# Altium project BEE-1012 PAY-IF V110.PrjPcb (part 7 of 8)

## Sheet TEMP.SchDoc
size 420 x 297 mm; SheetNumber: 18; SheetTotal: 32
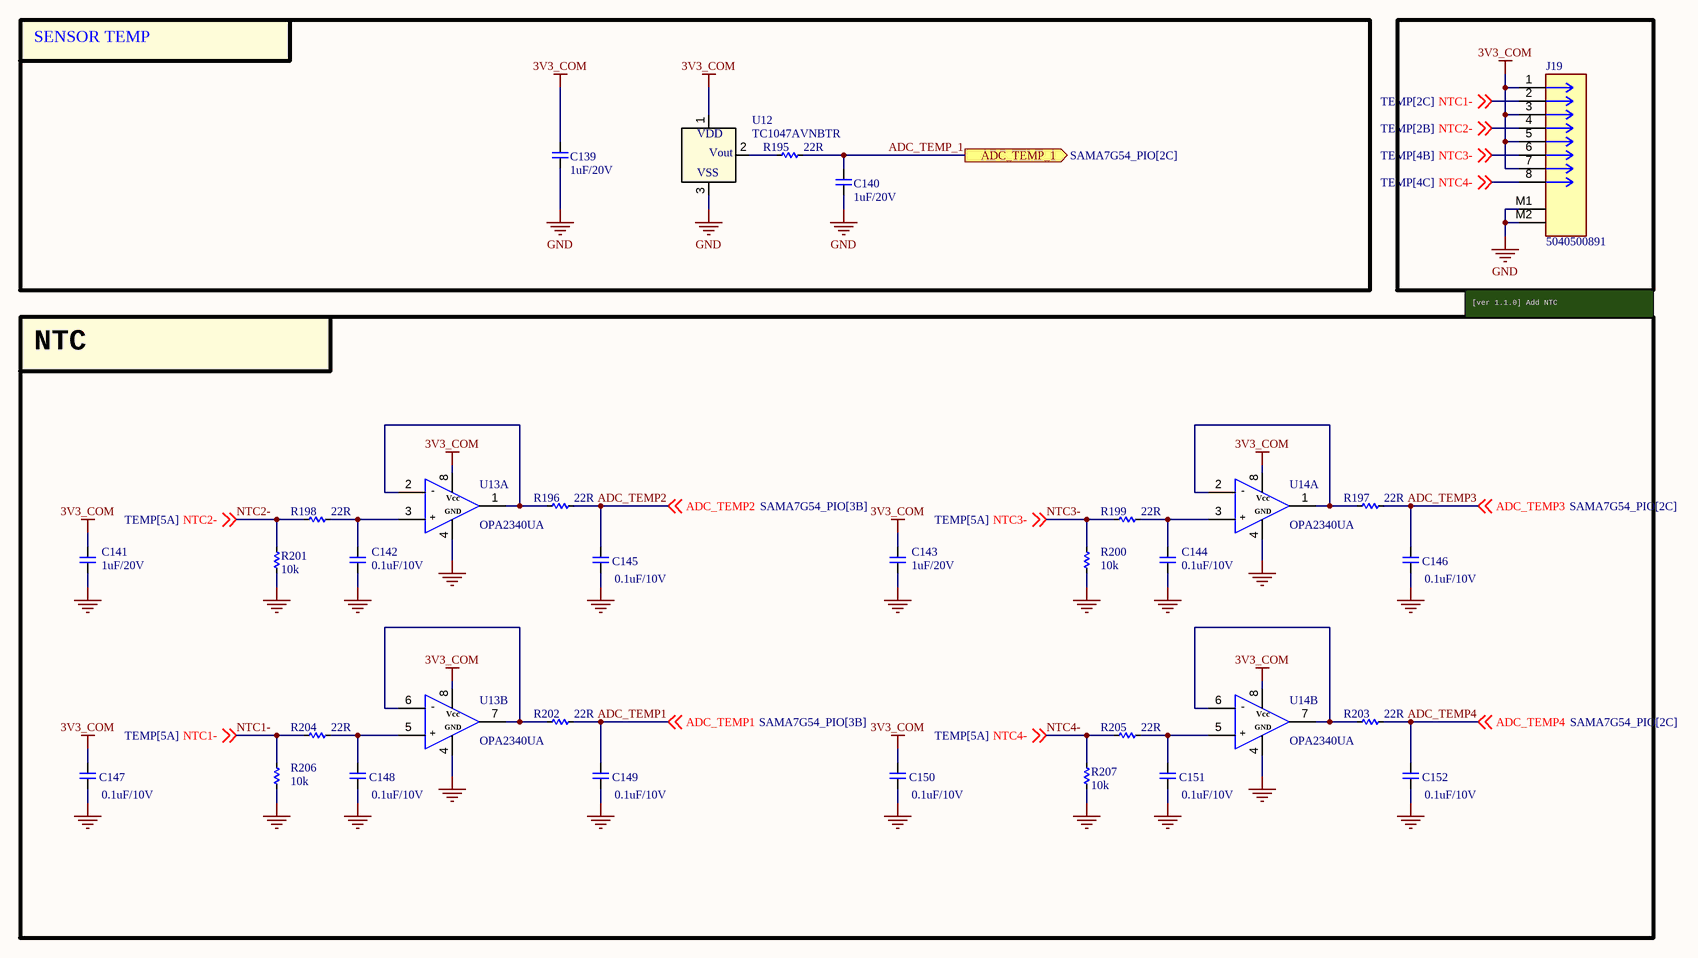
[diagram p19: TEMP.SchDoc]

### Parts
(Parts that share a designator on the sheet are numbered #1, #2 ... from top to bottom, then left to right.)
C139  1uF/20V  [CAP_C_1005X50_L]
C140  1uF/20V  [CAP_C_1005X50_L]
C141  1uF/20V  [CAP_C_1005X50_L]
C142  0.1uF/10V  [CAP_C_1005X50_L]
C143  1uF/20V  [CAP_C_1005X50_L]
C144  0.1uF/10V  [CAP_C_1005X50_L]
C145  0.1uF/10V  [CAP_C_1005X50_L]
C146  0.1uF/10V  [CAP_C_1005X50_L]
C147  0.1uF/10V  [CAP_C_1005X50_L]
C148  0.1uF/10V  [CAP_C_1005X50_L]
C149  0.1uF/10V  [CAP_C_1005X50_L]
C150#2  0.1uF/10V  [CAP_C_1005X50_L]
C151  0.1uF/10V  [CAP_C_1005X50_L]
C152  0.1uF/10V  [CAP_C_1005X50_L]
J19  5040500891  [MOLEX_5040500891]
R195  22R  [RES_C_1005x30_L]
R196  22R  [RES_C_1005x30_L]
R197  22R  [RES_C_1005x30_L]
R198  22R  [RES_C_1005x30_L]
R199  22R  [RES_C_1005x30_L]
R200  10k  [RES_C_1005x30_L]
R201  10k  [RES_C_1005x30_L]
R202  22R  [RES_C_1005x30_L]
R203  22R  [RES_C_1005x30_L]
R204  22R  [RES_C_1005x30_L]
R205  22R  [RES_C_1005x30_L]
R206  10k  [RES_C_1005x30_L]
R207  10k  [RES_C_1005x30_L]
U12  TC1047AVNBTR  [SOT-23_MC_MCH]
U13  OPA2340UA  [SOIC127P602X173-8N]  (parts A,B of 2)
U14  OPA2340UA  [SOIC127P602X173-8N]  (parts A,B of 2)

### Blocks framed on the sheet
SENSOR TEMP: C139 C140 R195 U12
NTC: C141-C149 C150#2 C151 C152 R196-R207 U13 U14

### Ports
ADC_TEMP_1 (out, see SAMA7G54_PIO[2C])

### Nets
3V3_COM: C139.2 C141.2 C143.2 C147.2 C150#2.2 J19.1 J19.3 J19.5 J19.7 U12.1(VDD) U13.8 U14.8
GND: C139.1 C140.1 C141.1 C142.1 C143.1 C144.1 C145.1 C146.1 C147.1 C148.1 C149.1 C150#2.1 C151.1 C152.1 J19.M1 J19.M2 R200.1 R201.1 R206.1 R207.1 U12.3(VSS) U13.4 U14.4
ADC_TEMP1: C149.2 R202.2 ; off-sheet ADC_TEMP1
ADC_TEMP2: C145.2 R196.2 ; off-sheet ADC_TEMP2
ADC_TEMP3: C146.2 R197.2 ; off-sheet ADC_TEMP3
ADC_TEMP4: C152.2 R203.2 ; off-sheet ADC_TEMP4
ADC_TEMP_1: C140.2 R195.2 ; port ADC_TEMP_1
NTC1-: J19.2 R204.1 R206.2 ; off-sheet NTC1-
NTC2-: J19.4 R198.1 R201.2 ; off-sheet NTC2-
NTC3-: J19.6 R199.1 R200.2 ; off-sheet NTC3-
NTC4-: J19.8 R205.1 R207.2 ; off-sheet NTC4-
NetC142_2: C142.2 R198.2 U13.3
NetC144_2: C144.2 R199.2 U14.3
NetC148_2: C148.2 R204.2 U13.5
NetC151_2: C151.2 R205.2 U14.5
NetR195_1: R195.1 U12.2(VOUT)
NetR196_1: R196.1 U13.1 U13.2
NetR197_1: R197.1 U14.1 U14.2
NetR202_1: R202.1 U13.6 U13.7
NetR203_1: R203.1 U14.6 U14.7

### Notes on the sheet
- [ver 1.1.0] Add NTC
- Project:
- Sub-system:
- Design by:
- Sheet title:
- Sheet
- A3
- of
- Checked by:
- Approved by:
- Revision:
- Document No:
- Size:
- Date:
- (in symbol OPA2340UA, part A) -; Vcc; GND; +
- (in symbol OPA2340UA, part B) -; Vcc; GND; +
- (in symbol TC1047AVNBTR) Vout

### Library data of the parts
C139-C141 C143 = _CAP_C_2: CAP CHIP
C142 C144-C149 C150#2 C151 C152 = _CAP_C_2: CAP
J19 = 5040500891: Connector Header Surface Mount, Right Angle 8 position 0.059" (1.50mm)`
R195-R207 = _RES_B_2: RES
U12 = TC1047AVNBTR: SENSOR ANALOG -40C-125C SOT23-3; Manufacturer_Name: Microchip; Copyright: Copyright (C) 2025 Ultra Librarian. All rights reserved.; Manufacturer_Part_Number: TC1047AVNBTR; RefDes: RefDes; Type: Type

## Sheet RTC.SchDoc
size 420 x 297 mm; SheetNumber: 19; SheetTotal: 32
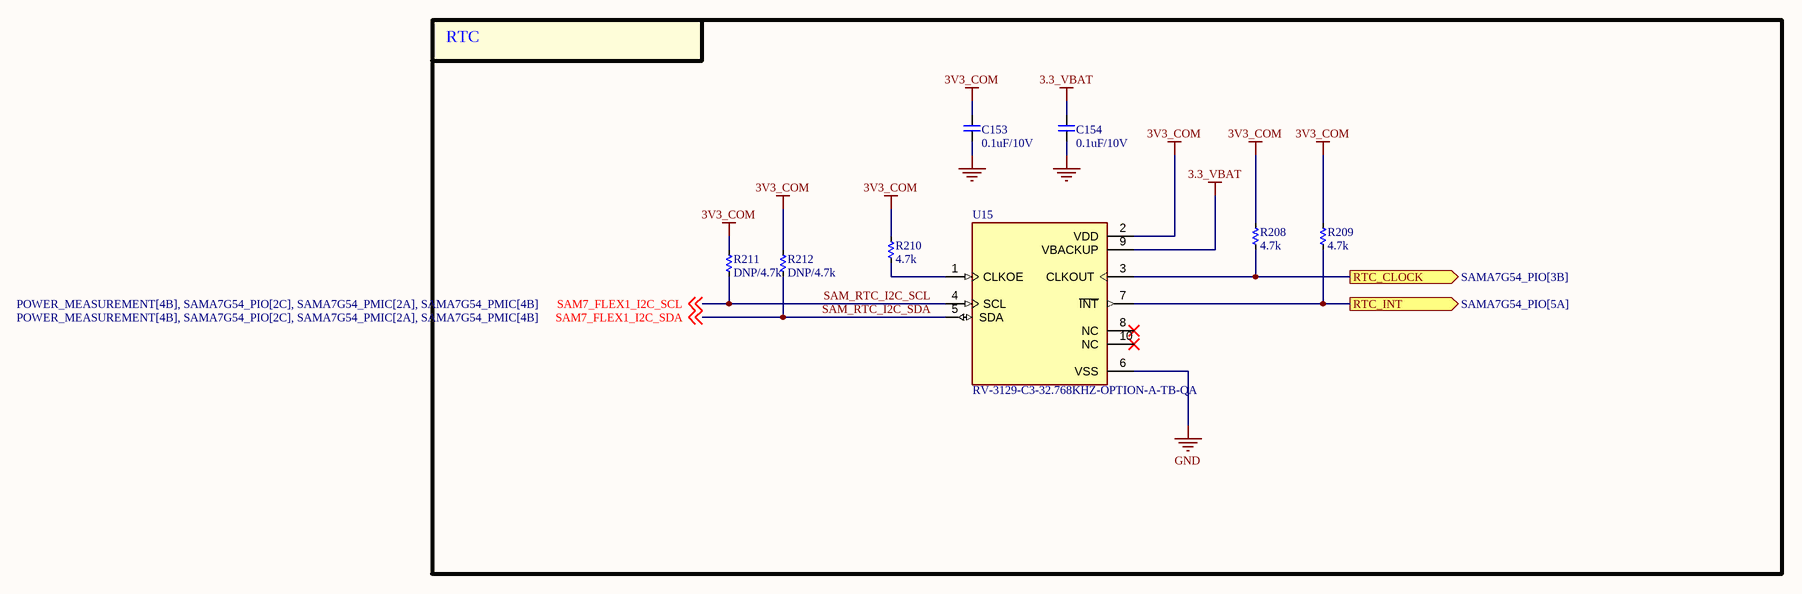
[diagram p20: RTC.SchDoc]

### Parts
C153  0.1uF/10V  [CAP_C_1005X50_L]
C154  0.1uF/10V  [CAP_C_1005X50_L]
R208  4.7k  [RES_C_1005x30_L]
R209  4.7k  [RES_C_1005x30_L]
R210  4.7k  [RES_C_1005x30_L]
R211  DNP/4.7k  [RES_C_1005x30_L]
R212  DNP/4.7k  [RES_C_1005x30_L]
U15  RV-3129-C3-32.768KHZ-OPTION-A-TB-QA  [IC_RV-3129-C3-32.768KHZ-OPTION-A-TB-QA]

### Blocks framed on the sheet
RTC: C153 C154 R208-R212 U15

### Ports
RTC_CLOCK (out, see SAMA7G54_PIO[3B]), RTC_INT (out, see SAMA7G54_PIO[5A])

### Nets
3.3_VBAT: C154.2 U15.9(VBACKUP)
3V3_COM: C153.2 R208.1 R209.1 R210.1 R211.1 R212.1 U15.2(VDD)
GND: C153.1 C154.1 U15.6(VSS)
SAM_RTC_I2C_SCL: R211.2 U15.4(SCL) ; off-sheet SAM7_FLEX1_I2C_SCL  [also labelled SAM7_FLEX1_I2C_SCL]
SAM_RTC_I2C_SDA: R212.2 U15.5(SDA) ; off-sheet SAM7_FLEX1_I2C_SDA  [also labelled SAM7_FLEX1_I2C_SDA]
NetR64_1: R209.2 U15.7(~{INT}) ; port RTC_INT
NetR116_1: R208.2 U15.3(CLKOUT) ; port RTC_CLOCK
NetR210_2: R210.2 U15.1(CLKOE)

Not connected (* = marked no-connect by the designer): U15 8(NC)* 10(NC)*

### Notes on the sheet
- Project:
- Sub-system:
- Design by:
- Sheet title:
- Sheet
- A3
- of
- Checked by:
- Approved by:
- Revision:
- Document No:
- Size:
- Date:

### Library data of the parts
C153 C154 = _CAP_C_2: CAP
R208-R212 = _RES_B_2: RES
U15 = RV-3129-C3-32.768KHZ-OPTION-A-TB-QA: Real-Time Clock Module with I2C-Bus; MP: RV-3129-C3-32.768KHZ-OPTION-A-TB-QA; Value: *; Price: None; Package: None; Availability: Unavailable

## Sheet WATCHDOG.SchDoc
size 420 x 297 mm; SheetNumber: 20; SheetTotal: 32
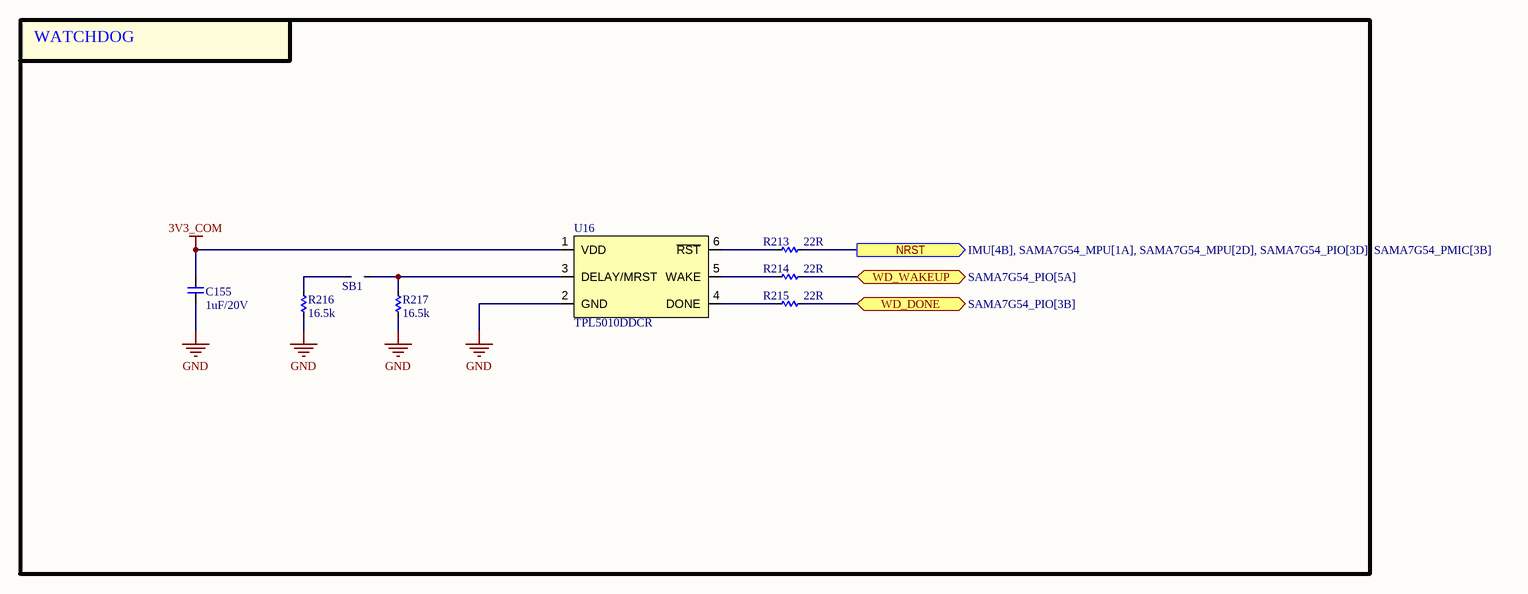
[diagram p21: WATCHDOG.SchDoc]

### Parts
C155  1uF/20V  [CAP_C_1005X50_L]
R213  22R  [RES_C_1005x30_L]
R214  22R  [RES_C_1005x30_L]
R215  22R  [RES_C_1005x30_L]
R216  16.5k  [RES_C_1005x30_L]
R217  16.5k  [RES_C_1005x30_L]
SB1  JUMPER  [JUMPER_1608]  (value not drawn)
U16  TPL5010DDCR  [TPL5010DDCR]

### Blocks framed on the sheet
WATCHDOG: C155 R213-R217 SB1 U16

### Ports
NRST (out, see IMU[4B], SAMA7G54_MPU[1A], SAMA7G54_MPU[2D], SAMA7G54_PIO[3D], SAMA7G54_PMIC[3B]), WD_DONE (bidir, see SAMA7G54_PIO[3B]), WD_WAKEUP (bidir, see SAMA7G54_PIO[5A])

### Nets
3V3_COM: C155.2 U16.1(VDD)
GND: C155.1 R216.2 R217.2 U16.2(GND)
NetC75_2: R213.2 ; port NRST
NetR67_1: R214.2 ; port WD_WAKEUP
NetR111_1: R215.2 ; port WD_DONE
NetR213_1: R213.1 U16.6(~{RST})
NetR214_1: R214.1 U16.5(WAKE)
NetR215_1: R215.1 U16.4(DONE)
NetR216_1: R216.1 SB1.1
NetR217_1: R217.1 SB1.2 U16.3(DELAY/MRST)

### Notes on the sheet
- Project:
- Sub-system:
- Design by:
- Sheet title:
- Sheet
- A3
- of
- Checked by:
- Approved by:
- Revision:
- Document No:
- Size:
- Date:

### Library data of the parts
C155 = _CAP_C_2: CAP CHIP
R213-R217 = _RES_B_2: RES
U16 = TPL5010DDCR: OSC PROG TIMER TSOT23-6

## Sheet LVDS.SchDoc
size 420 x 297 mm; SheetNumber: 21; SheetTotal: 32
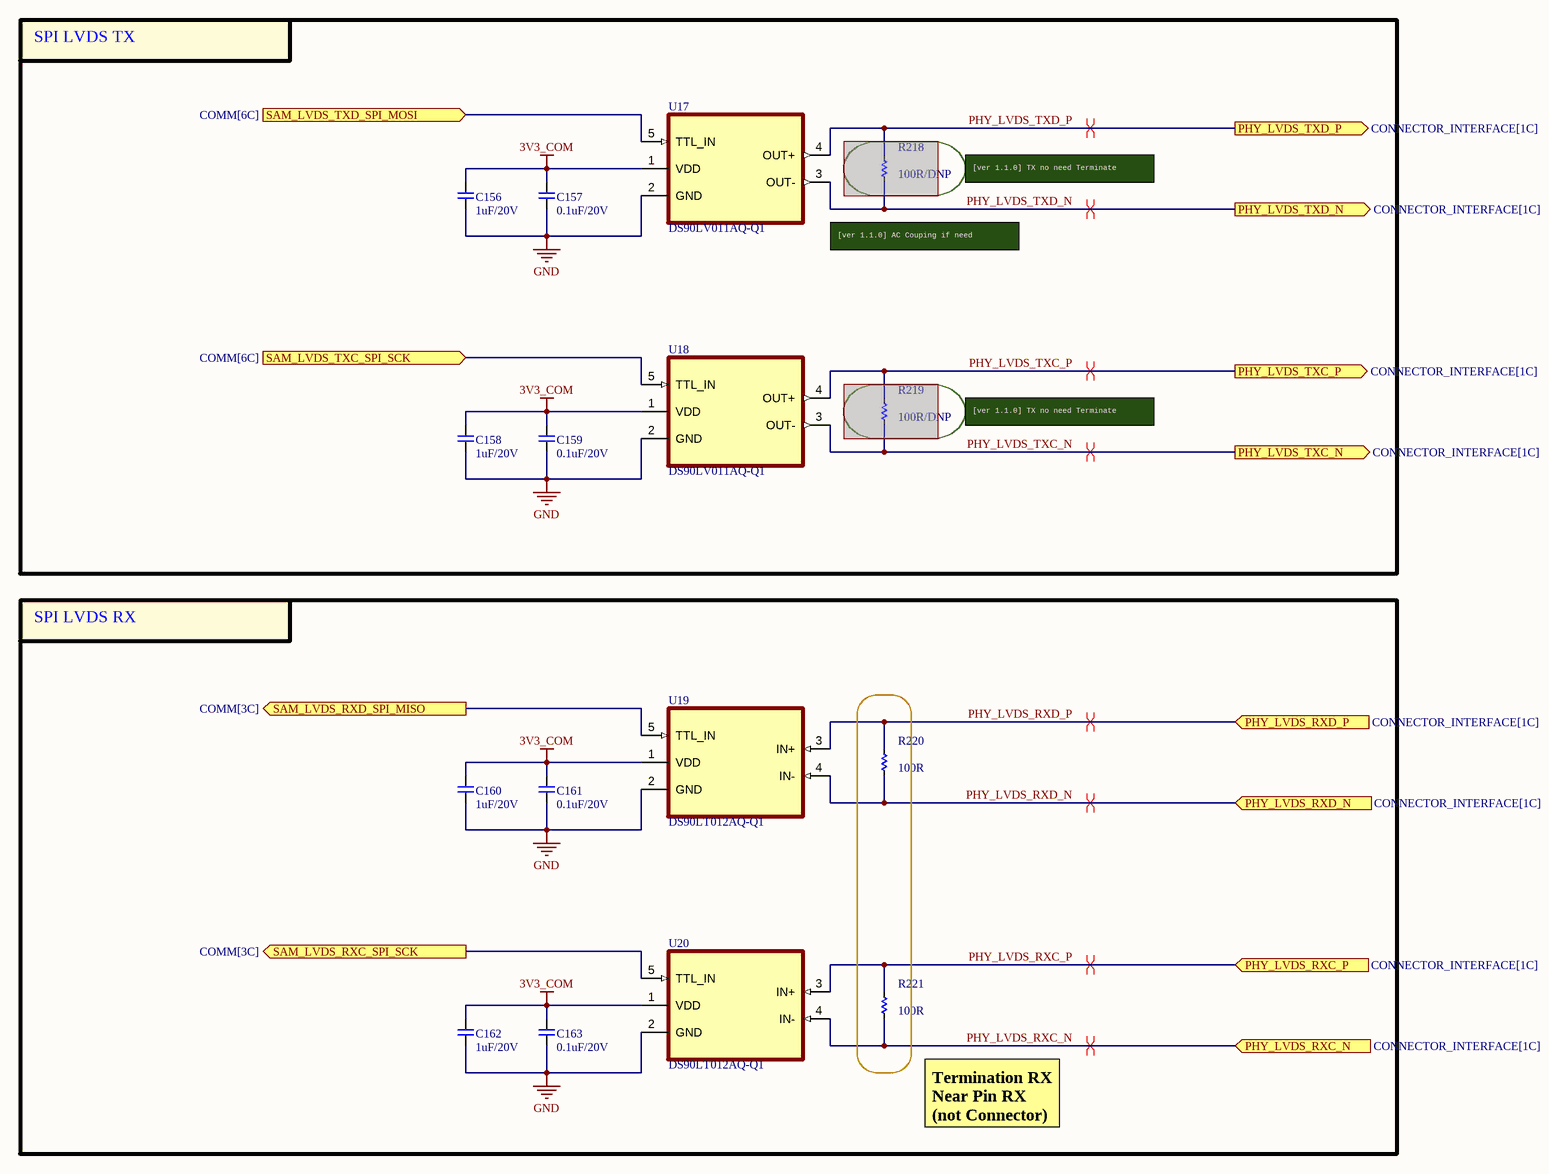
[diagram p22: LVDS.SchDoc]

### Parts
(Parts that share a designator on the sheet are numbered #1, #2 ... from top to bottom, then left to right.)
C156  1uF/20V  [CAP_C_1005X50_L]
C157  0.1uF/20V  [CAP_C_1005X50_L]
C158  1uF/20V  [CAP_C_1005X50_L]
C159  0.1uF/20V  [CAP_C_1005X50_L]
C160  1uF/20V  [CAP_C_1005X50_L]
C161  0.1uF/20V  [CAP_C_1005X50_L]
C162  1uF/20V  [CAP_C_1005X50_L]
C163  0.1uF/20V  [CAP_C_1005X50_L]
R218#2  100R/DNP  [RES_C_1005x30_L]  (masked out: inside a compile mask, not in the netlist)
R219#2  100R/DNP  [RES_C_1005x30_L]  (masked out: inside a compile mask, not in the netlist)
R220  100R  [RES_C_1005x30_L]
R221  100R  [RES_C_1005x30_L]
U17  DS90LV011AQ-Q1  [DS90LV011AQ-Q1]
U18  DS90LV011AQ-Q1  [DS90LV011AQ-Q1]
U19  DS90LT012AQ-Q1  [DS90LV011AQ-Q1]
U20  DS90LT012AQ-Q1  [DS90LV011AQ-Q1]

### Blocks framed on the sheet
SPI LVDS TX: C156-C159 R218#2 R219#2 U17 U18
SPI LVDS RX: C160-C163 R220 R221 U19 U20

### Ports
PHY_LVDS_RXC_N (in, see CONNECTOR_INTERFACE[1C]), PHY_LVDS_RXC_P (in, see CONNECTOR_INTERFACE[1C]), PHY_LVDS_RXD_N (in, see CONNECTOR_INTERFACE[1C]), PHY_LVDS_RXD_P (in, see CONNECTOR_INTERFACE[1C]), PHY_LVDS_TXC_N (out, see CONNECTOR_INTERFACE[1C]), PHY_LVDS_TXC_P (out, see CONNECTOR_INTERFACE[1C]), PHY_LVDS_TXD_N (out, see CONNECTOR_INTERFACE[1C]), PHY_LVDS_TXD_P (out, see CONNECTOR_INTERFACE[1C]), SAM_LVDS_RXC_SPI_SCK (out, see COMM[3C]), SAM_LVDS_RXD_SPI_MISO (out, see COMM[3C]), SAM_LVDS_TXC_SPI_SCK (in, see COMM[6C]), SAM_LVDS_TXD_SPI_MOSI (in, see COMM[6C])

### Nets
3V3_COM: C156.2 C157.2 C158.2 C159.2 C160.2 C161.2 C162.2 C163.2 U17.1(VDD) U18.1(VDD) U19.1(VDD) U20.1(VDD)
GND: C156.1 C157.1 C158.1 C159.1 C160.1 C161.1 C162.1 C163.1 U17.2(GND) U18.2(GND) U19.2(GND) U20.2(GND)
PHY_LVDS_RXC_N: R221.2 U20.4(IN-) ; port PHY_LVDS_RXC_N
PHY_LVDS_RXC_P: R221.1 U20.3(IN+) ; port PHY_LVDS_RXC_P
PHY_LVDS_RXD_N: R220.2 U19.4(IN-) ; port PHY_LVDS_RXD_N
PHY_LVDS_RXD_P: R220.1 U19.3(IN+) ; port PHY_LVDS_RXD_P
PHY_LVDS_TXC_N: U18.3(OUT-) ; port PHY_LVDS_TXC_N
PHY_LVDS_TXC_P: U18.4(OUT+) ; port PHY_LVDS_TXC_P
PHY_LVDS_TXD_N: U17.3(OUT-) ; port PHY_LVDS_TXD_N
PHY_LVDS_TXD_P: U17.4(OUT+) ; port PHY_LVDS_TXD_P
NetU10#1_5: U18.5(TTL_IN) ; port SAM_LVDS_TXC_SPI_SCK
NetU10#1_11: U17.5(TTL_IN) ; port SAM_LVDS_TXD_SPI_MOSI
NetU11_5: U20.5(TTL_IN) ; port SAM_LVDS_RXC_SPI_SCK
NetU11_14: U19.5(TTL_IN) ; port SAM_LVDS_RXD_SPI_MISO

### Layout directives
differential pair: PHY_LVDS_RXC_N, PHY_LVDS_RXC_P, PHY_LVDS_RXD_N, PHY_LVDS_RXD_P, PHY_LVDS_TXC_N, PHY_LVDS_TXC_P, PHY_LVDS_TXD_N, PHY_LVDS_TXD_P

### Notes on the sheet
- [ver 1.1.0] TX no need Terminate
- [ver 1.1.0] AC Couping if need
- Termination RX
  Near Pin RX (not Connector)
- Project:
- Sub-system:
- Design by:
- Sheet title:
- Sheet
- A3
- of
- Checked by:
- Approved by:
- Revision:
- Document No:
- Size:
- Date:

### Library data of the parts
C156-C163 = _CAP_C_2: CAP CHIP
R218#2 R219#2 R220 R221 = _RES_B_2: RES
U17 U18 = DS90LV011AQ-Q1: Automotive LVDS Differential Driver
U19 U20 = DS90LT012AQ-Q1: Automotive LVDS Differential Line Receiver

## Sheet CAN_PHY.SchDoc
size 420 x 297 mm; SheetNumber: 22; SheetTotal: 32
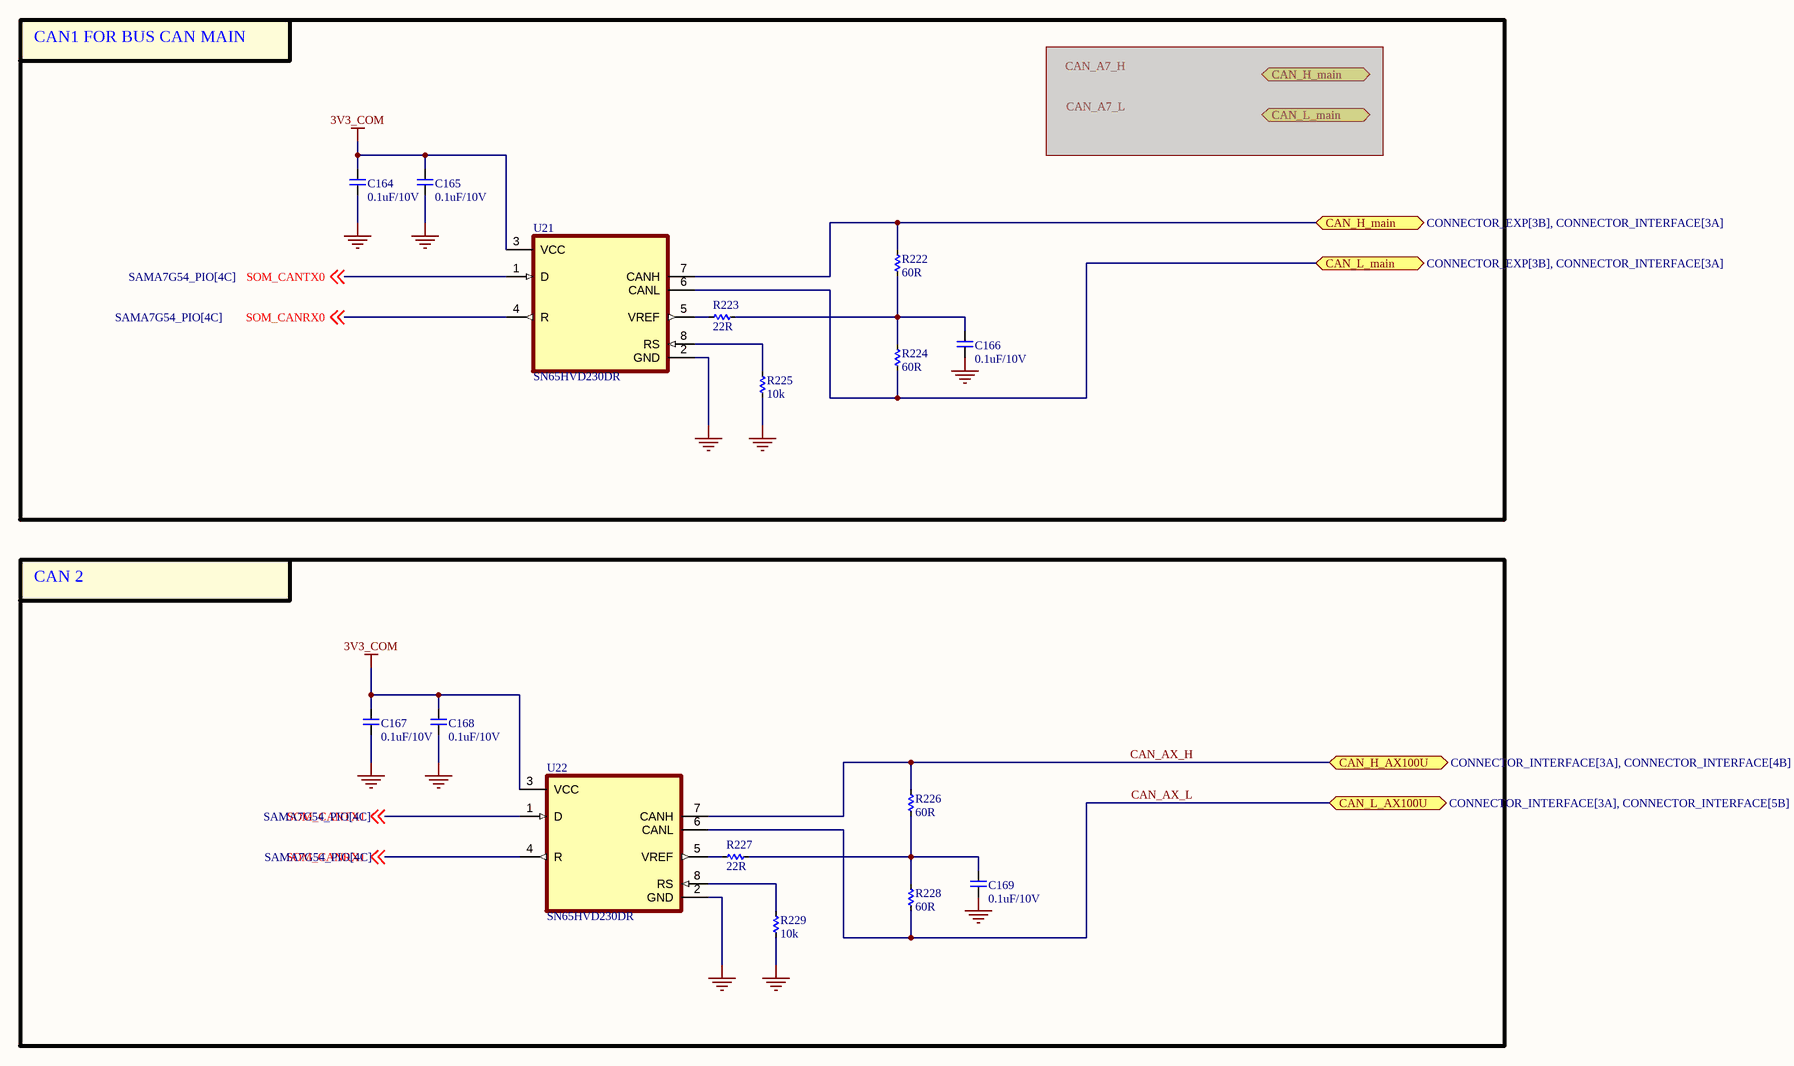
[diagram p23: CAN_PHY.SchDoc]

### Parts
(Parts that share a designator on the sheet are numbered #1, #2 ... from top to bottom, then left to right.)
C164  0.1uF/10V  [CAP_C_1005X50_L]
C165  0.1uF/10V  [CAP_C_1005X50_L]
C166  0.1uF/10V  [CAP_C_1005X50_L]
C167  0.1uF/10V  [CAP_C_1005X50_L]
C168  0.1uF/10V  [CAP_C_1005X50_L]
C169  0.1uF/10V  [CAP_C_1005X50_L]
R222  60R  [RES_C_1005x30_L]
R223  22R  [RES_C_1005x30_L]
R224  60R  [RES_C_1005x30_L]
R225  10k  [RES_C_1005x30_L]
R226#1  60R  [RES_C_1005x30_L]
R227#1  22R  [RES_C_1005x30_L]
R228#1  60R  [RES_C_1005x30_L]
R229  10k  [RES_C_1005x30_L]
U21  SN65HVD230DR  [SOIC127P602X173-8N]
U22#1  SN65HVD230DR  [SOIC127P602X173-8N]

### Blocks framed on the sheet
CAN1 FOR BUS CAN MAIN: C164-C166 R222-R225 U21
CAN 2: C167-C169 R226#1 R227#1 R228#1 R229 U22#1

### Ports
CAN_H_AX100U (bidir, see CONNECTOR_INTERFACE[3A], CONNECTOR_INTERFACE[4B]), CAN_H_main (bidir, see CAN_PHY[5A], CONNECTOR_EXP[4B], CONNECTOR_INTERFACE[4A]), CAN_H_main (bidir, see CONNECTOR_EXP[3B], CONNECTOR_INTERFACE[3A]), CAN_L_AX100U (bidir, see CONNECTOR_INTERFACE[3A], CONNECTOR_INTERFACE[5B]), CAN_L_main (bidir, see CAN_PHY[5A], CONNECTOR_EXP[4B], CONNECTOR_INTERFACE[4A]), CAN_L_main (bidir, see CONNECTOR_EXP[3B], CONNECTOR_INTERFACE[3A])

### Nets
3V3_COM: C164.2 C165.2 C167.2 C168.2 U21.3(VCC) U22#1.3(VCC)
GND: C164.1 C165.1 C166.1 C167.1 C168.1 C169.1 R225.2 R229.2 U21.2(GND) U22#1.2(GND)
CAN_AX_H: R226#1.1 U22#1.7(CANH) ; port CAN_H_AX100U
CAN_AX_L: R228#1.2 U22#1.6(CANL) ; port CAN_L_AX100U
CAN_H_main: R222.1 U21.7(CANH) ; port CAN_H_main
CAN_L_main: R224.2 U21.6(CANL) ; port CAN_L_main
SOM_CANRX0: U21.4(R) ; off-sheet SOM_CANRX0
SOM_CANRX1: U22#1.4(R) ; off-sheet SOM_CANRX1
SOM_CANTX0: U21.1(D) ; off-sheet SOM_CANTX0
SOM_CANTX1: U22#1.1(D) ; off-sheet SOM_CANTX1
NetC166_2: C166.2 R222.2 R223.1 R224.1
NetC169_2: C169.2 R226#1.2 R227#1.1 R228#1.1
NetR223_2: R223.2 U21.5(VREF)
NetR225_1: R225.1 U21.8(RS)
NetR227#1_2: R227#1.2 U22#1.5(VREF)
NetR229_1: R229.1 U22#1.8(RS)

### Notes on the sheet
- Project:
- Sub-system:
- Design by:
- Sheet title:
- Sheet
- A3
- of
- Checked by:
- Approved by:
- Revision:
- Document No:
- Size:
- Date:

### Library data of the parts
C164-C169 = _CAP_C_2: CAP
R222-R225 R226#1 R227#1 R228#1 R229 = _RES_B_2: RES
U21 U22#1 = SN65HVD230DR: 3.3 V CAN Transceiver with Standby Mode; MF: Texas Instruments; SnapEDA_Link: https://www.snapeda.com/parts/SN65HVD230DR/Texas+Instruments/view-part/?ref=snap; Package: SOIC-8 Texas Instruments; Value: *; MP: SN65HVD230DR; Check_prices: https://www.snapeda.com/parts/SN65HVD230DR/Texas+Instruments/view-part/?ref=eda

## Sheet IMU.SchDoc
size 420 x 297 mm; SheetNumber: 23; SheetTotal: 32
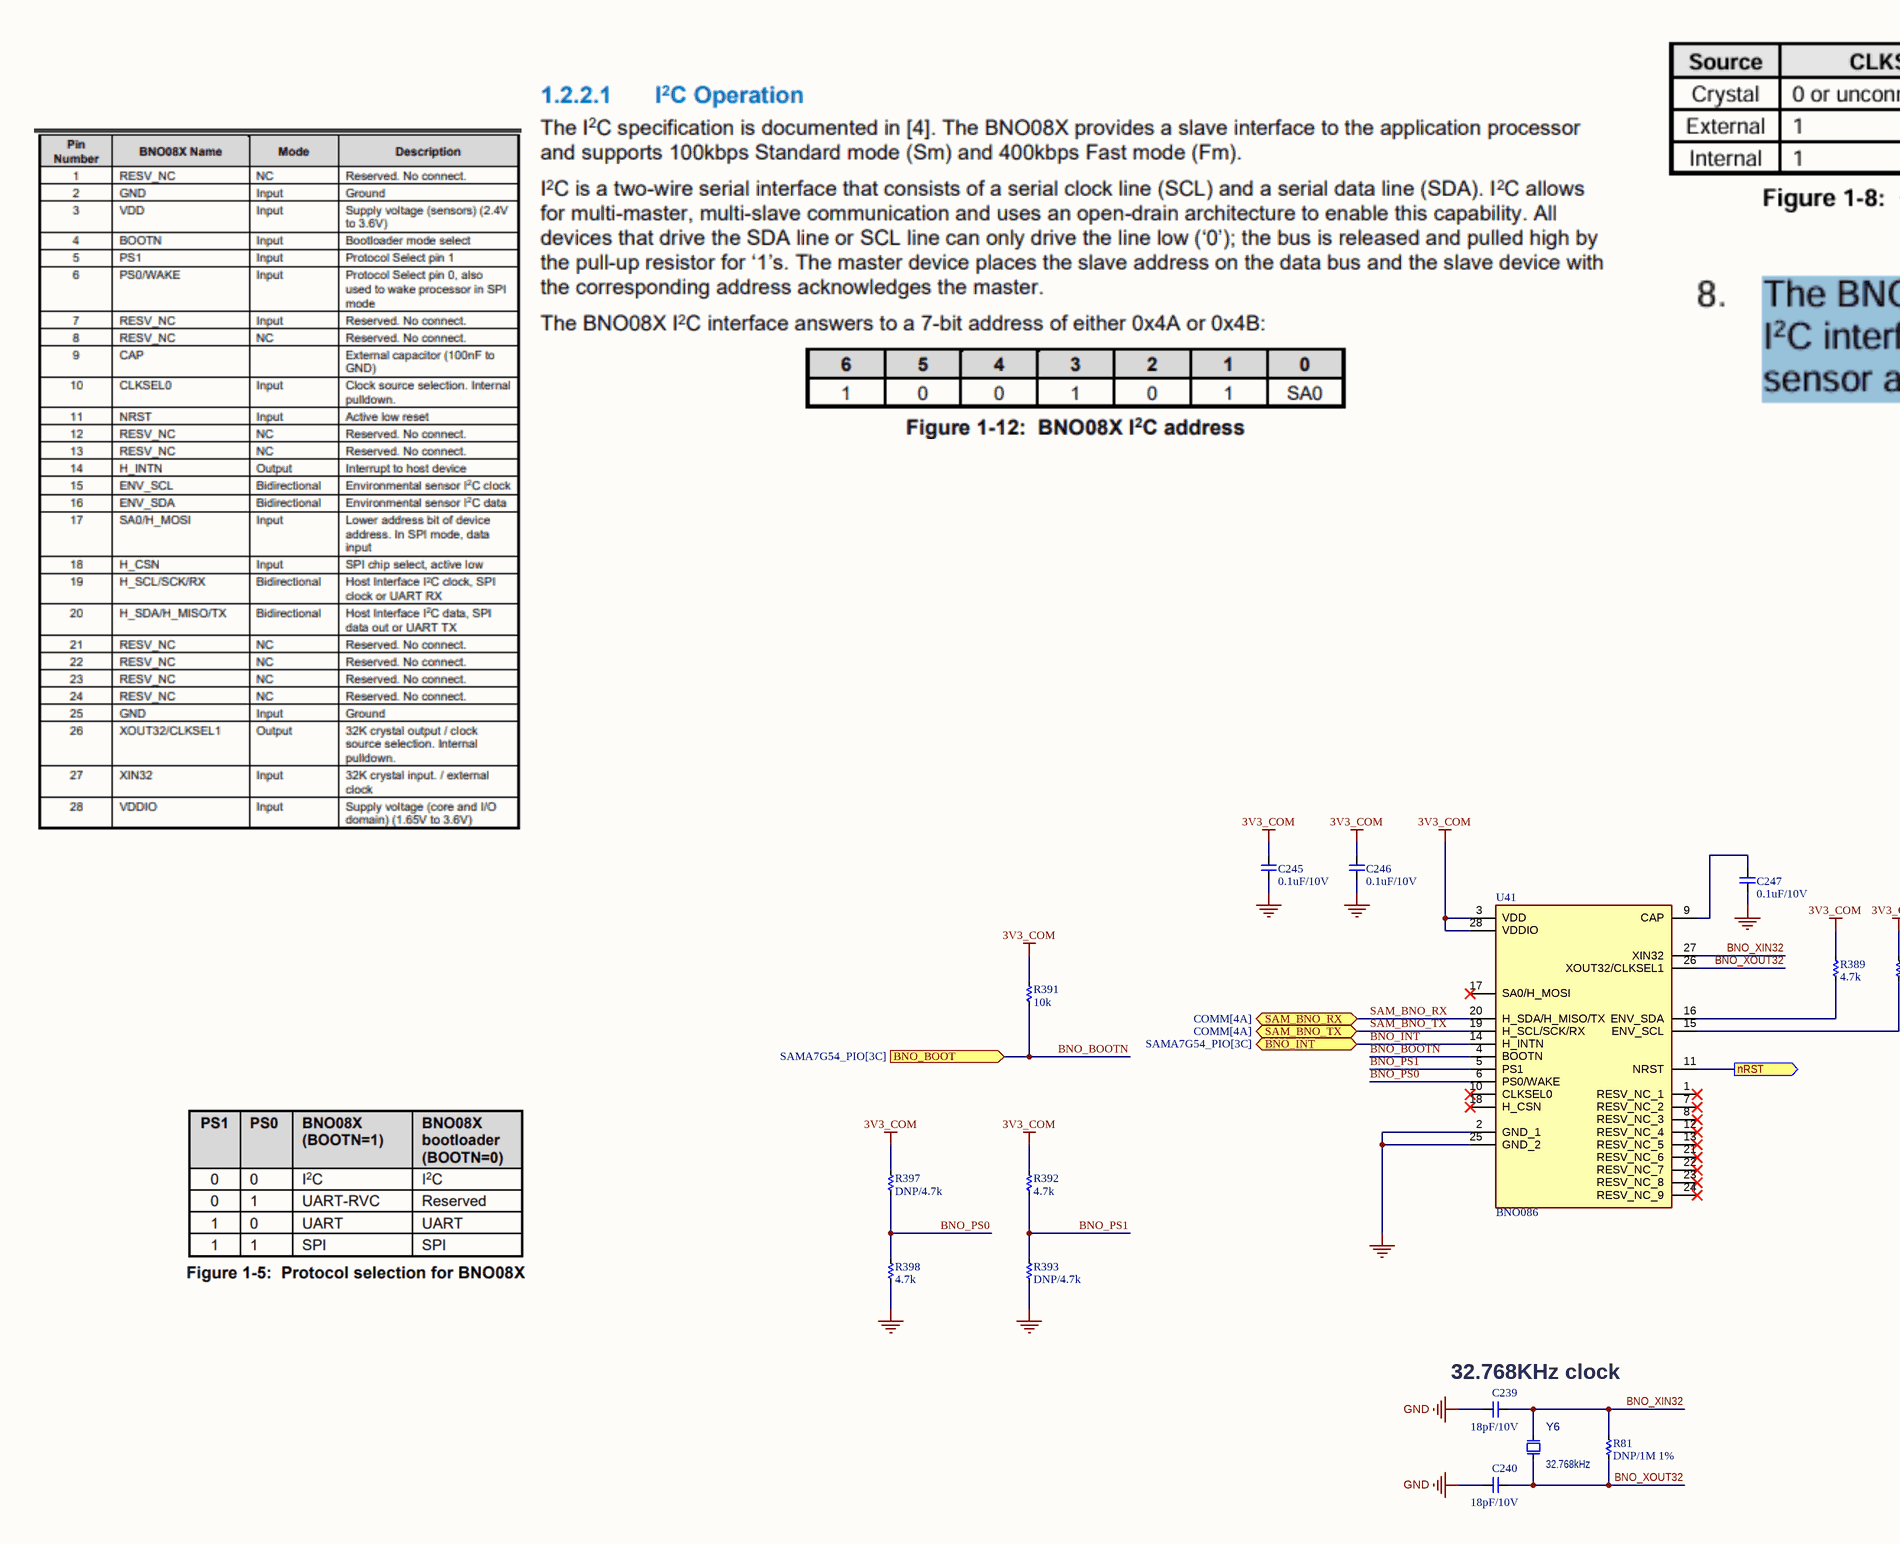
[diagram p24: IMU.SchDoc, left]
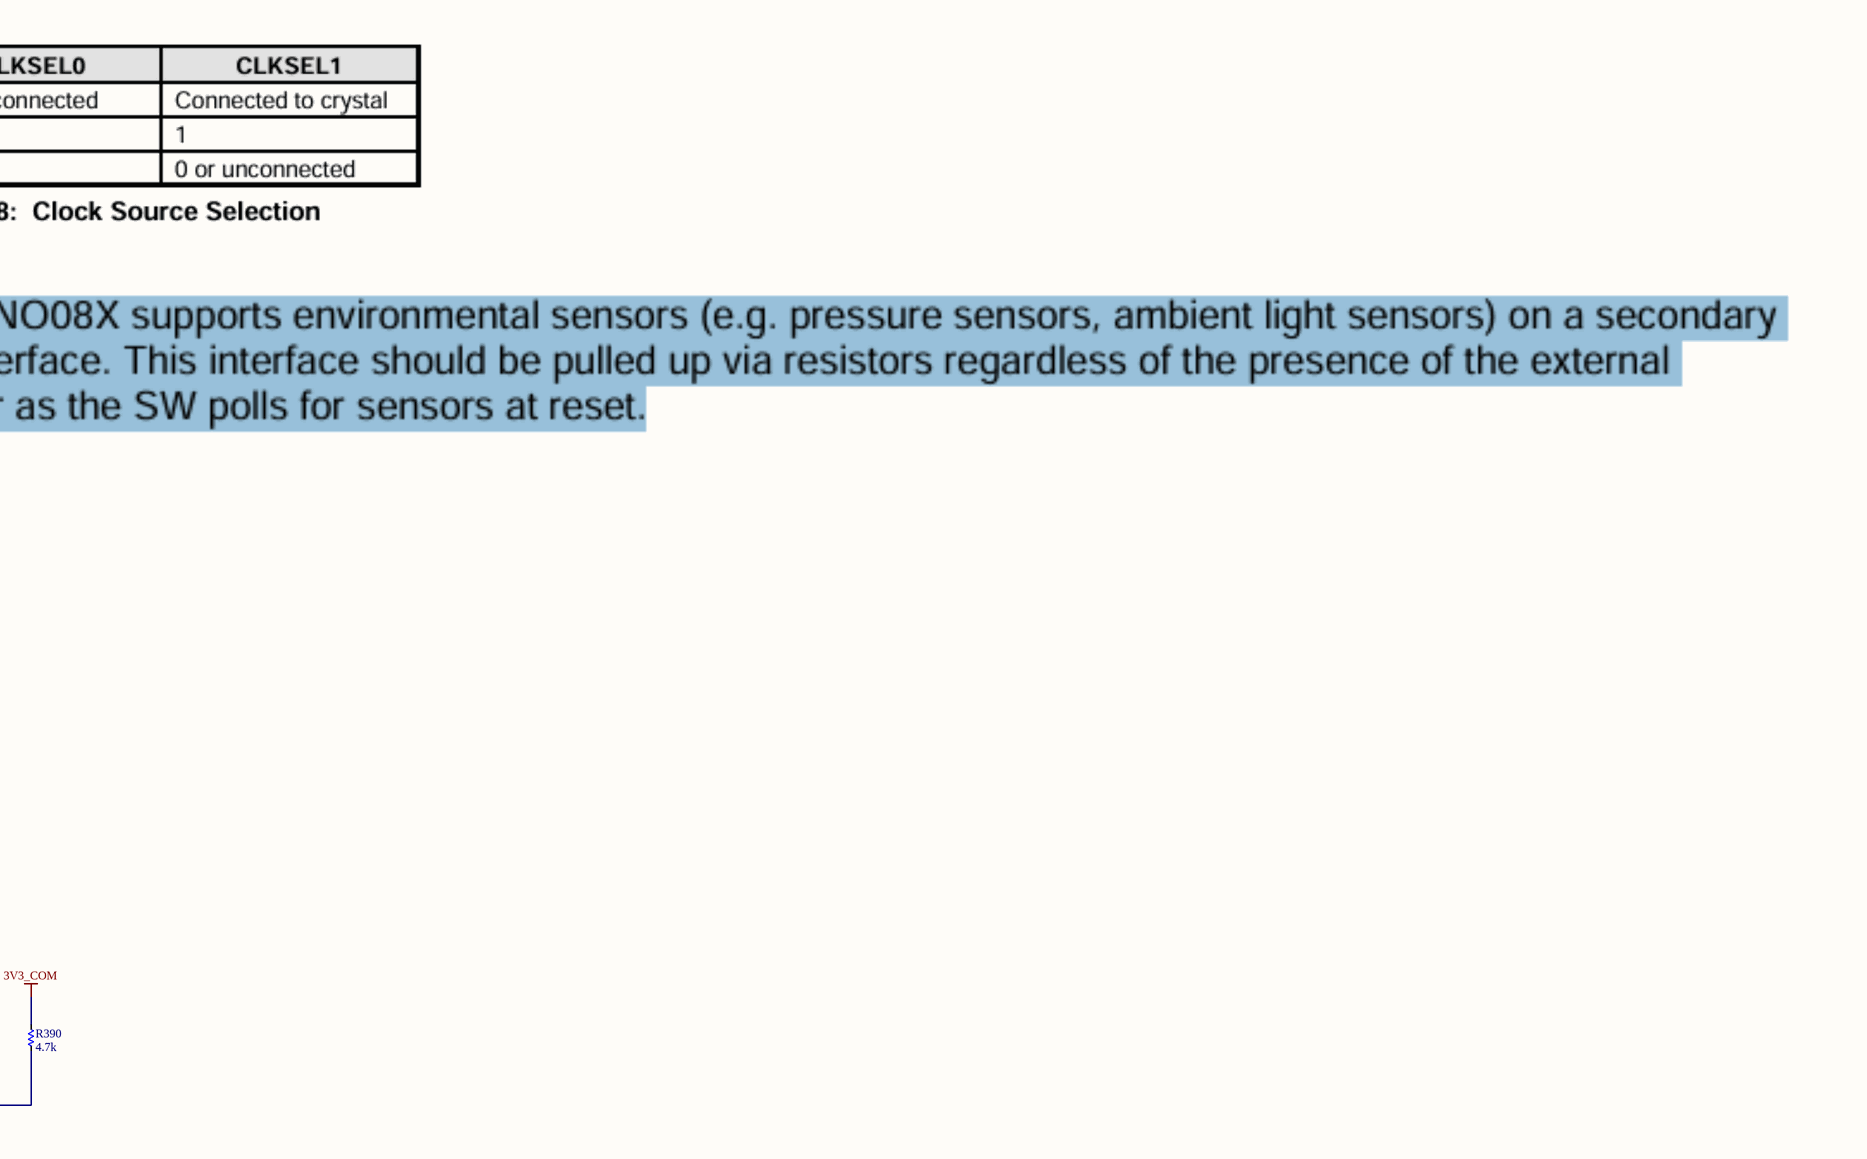
[diagram p25: IMU.SchDoc, right]

### Parts
(Parts that share a designator on the sheet are numbered #1, #2 ... from top to bottom, then left to right.)
C239  18pF/10V  [CAP_C_1005X50_L]
C240  18pF/10V  [CAP_C_1005X50_L]
C245  0.1uF/10V  [CAP_C_1005X50_L]
C246  0.1uF/10V  [CAP_C_1005X50_L]
C247  0.1uF/10V  [CAP_C_1005X50_L]
R81#2  DNP/1M 1%  [RES_C_1005x30_L]
R389  4.7k  [RES_C_1005x30_L]
R390  4.7k  [RES_C_1005x30_L]
R391  10k  [RES_C_1005x30_L]
R392  4.7k  [RES_C_1005x30_L]
R393  DNP/4.7k  [RES_C_1005x30_L]
R397  DNP/4.7k  [RES_C_1005x30_L]
R398  4.7k  [RES_C_1005x30_L]
U41  BNO086  [BNO086]
Y6  value 32.768kHz  [CRYSTAL_NX2012SA]  (hidden comment: Crystal 2 Pins)

### Ports
BNO_BOOT (in, see SAMA7G54_PIO[3C]), BNO_INT (bidir, see SAMA7G54_PIO[3C]), nRST (out, see SAMA7G54_MPU[1A], SAMA7G54_MPU[2D], SAMA7G54_PIO[3D], SAMA7G54_PMIC[3B], WATCHDOG[4B]), SAM_BNO_RX (bidir, see COMM[4A]), SAM_BNO_TX (bidir, see COMM[4A])

### Nets
3V3_COM: C245.2 C246.2 R389.1 R390.1 R391.1 R392.1 R397.1 U41.3(VDD) U41.28(VDDIO)
GND: C239.2 C240.2 C245.1 C246.1 C247.1 R393.2 R398.2 U41.2(GND_1) U41.25(GND_2)
BNO_BOOTN: R391.2 U41.4(BOOTN) ; port BNO_BOOT
BNO_INT: U41.14(H_INTN) ; port BNO_INT
BNO_PS0: R397.2 R398.1 U41.6(PS0/WAKE)
BNO_PS1: R392.2 R393.1 U41.5(PS1)
BNO_XIN32: C239.1 R81#2.1 U41.27(XIN32) Y6.2(Osc2)
BNO_XOUT32: C240.1 R81#2.2 U41.26(XOUT32/CLKSEL1) Y6.1(Osc1)
SAM_BNO_RX: U41.20(H_SDA/H_MISO/TX) ; port SAM_BNO_RX
SAM_BNO_TX: U41.19(H_SCL/SCK/RX) ; port SAM_BNO_TX
NetC75_2: U41.11(NRST) ; port nRST
NetC247_2: C247.2 U41.9(CAP)
NetR389_2: R389.2 U41.16(ENV_SDA)
NetR390_2: R390.2 U41.15(ENV_SCL)

Not connected (* = marked no-connect by the designer): U41 1(RESV_NC_1)* 7(RESV_NC_2)* 8(RESV_NC_3)* 10(CLKSEL0)* 12(RESV_NC_4)* 13(RESV_NC_5)* 17(SA0/H_MOSI)* 18(H_CSN)* 21(RESV_NC_6)* 22(RESV_NC_7)* 23(RESV_NC_8)* 24(RESV_NC_9)*

### Notes on the sheet
- (near C239) 32.768KHz clock
- Project:
- Sub-system:
- Design by:
- Sheet title:
- Sheet
- A3
- of
- Checked by:
- Approved by:
- Revision:
- Document No:
- Size:
- Date:

### Library data of the parts
C239 C240 C245-C247 = _CAP_C_2: CAP
R81#2 R389-R393 R397 R398 = _RES_B_2: RES
U41 = BNO086: Accelerometer, Gyroscope, Magnetometer, Temperature, 9 Axis Sensor IC, SPI Output; Manufacturer_Name: CEVA; Geometry.Height: 1.18mm; Mouser Part Number: 526-BNO086; Mouser Price/Stock: https://www.mouser.co.uk/ProductDetail/CEVA/BNO086?qs=ulEaXIWI0c%2FqTo1scjodAw%3D%3D; Manufacturer_Part_Number: BNO086; Datasheet Link: *
Y6 = OSC_32.768kHz: Crystal; Manufacturer 1: NDK; Manufacturer Part Number 1: NX2012SA-32.768K-STD-MUB-1; MCHP-ID: OSC1092; Description_: CRYSTAL 32.768kHz 12.5pF SMD NX2012SA; Dev Tools Status: Production; Owner: Jamus Griego; Tolerance: ±20ppm; Load Capacitance: 12.5pF; Populated: YES; Revision: 1; Symbol: Crystal 2 Pins; Status: MCL Design; ComponentLink1URL: https://chn-vm-apps.microchip.com/mchprepo/parts/Datasheets/c_NX2012SA-STD-MUB-1_e.pdf; ComponentLink1Description: SVN Datasheet; ComponentLink2URL: C:\ALTIUM_WORK\00001_MCHP-CDB\Datasheets\c_NX2012SA-STD-MUB-1_e.pdf; ComponentLink2Description: Local Datasheet; ComponentLink3URL: C:\ALTIUM_WORK\00001_MCHP-CDB\Library\LibraryRefs\Crystal 2 Pins.SchLib; ComponentLink3Description: Open Symbol; ComponentLink4URL: C:\ALTIUM_WORK\00001_MCHP-CDB\Library\Footprints\CRYSTAL_NX2012SA.PcbLib; ComponentLink4Description: Open Footprint; ComponentLink5Description: Open Footprint 2; ComponentLink6Description: Open Footprint 3; ComponentLink7Description: Open Footprint 4; Type: Crystal; Category: Crystal/Oscillator; Supplier 1: Digi-Key; Supplier Part Number 1: 644-1219-1-ND; Quantity Override: 1

## Sheet RS485.SchDoc
size 420 x 297 mm; SheetNumber: 24; SheetTotal: 32
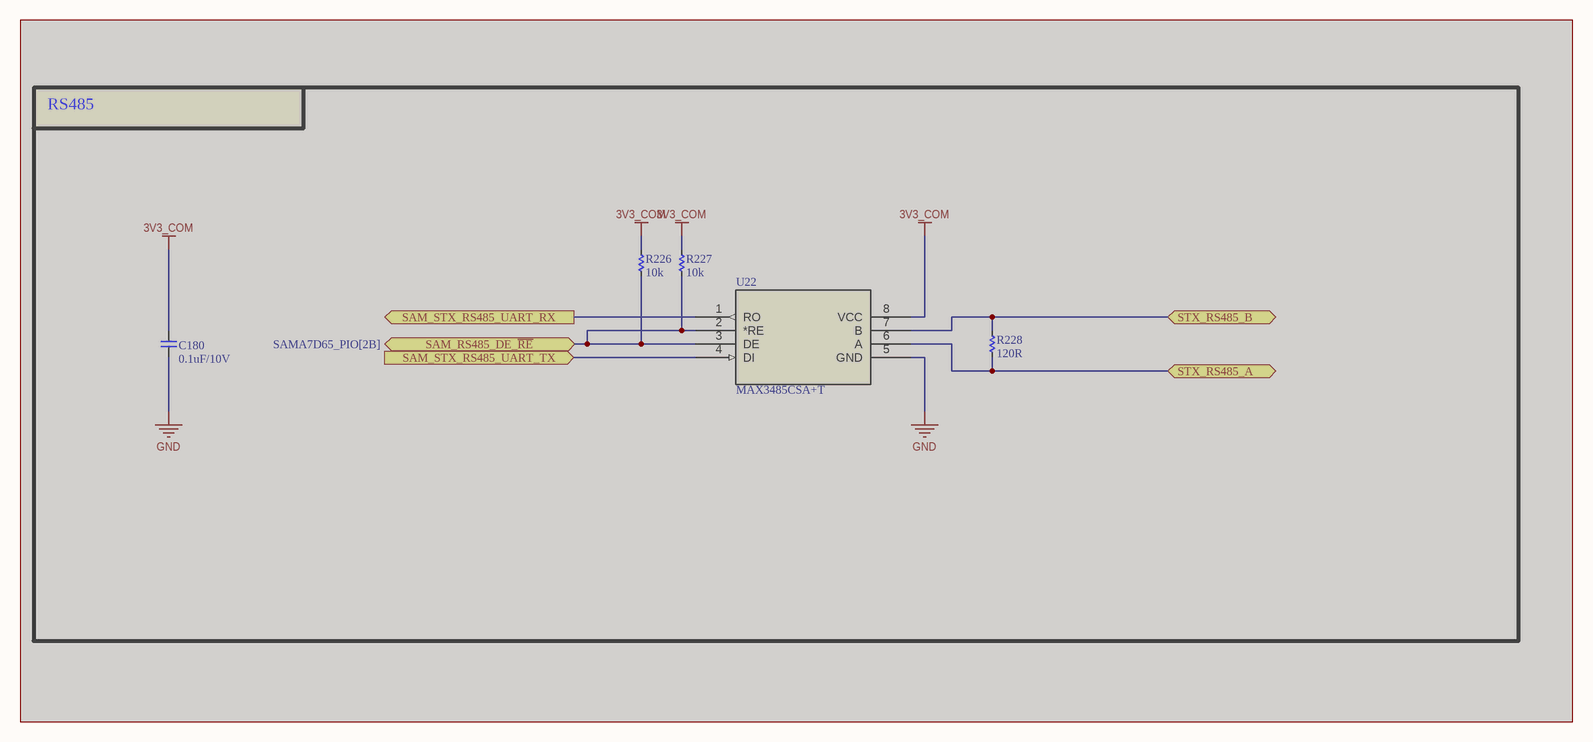
[diagram p26: RS485.SchDoc]

### Parts
(Parts that share a designator on the sheet are numbered #1, #2 ... from top to bottom, then left to right.)
C180#2  0.1uF/10V  [CAP_C_1005X50_L]  (masked out: inside a compile mask, not in the netlist)
R226#2  10k  [RES_C_1005x30_L]  (masked out: inside a compile mask, not in the netlist)
R227#2  10k  [RES_C_1005x30_L]  (masked out: inside a compile mask, not in the netlist)
R228#2  120R  [RES_C_1005x30_L]  (masked out: inside a compile mask, not in the netlist)
U22#2  MAX3485CSA+T  [21-0041-3-M_90-0096-8L_MXM]  (masked out: inside a compile mask, not in the netlist)

### Blocks framed on the sheet
RS485: C180#2 R226#2 R227#2 R228#2 U22#2

### Ports
SAM_RS485_DE_~{RE} (bidir, see SAMA7D65_PIO[2B]), SAM_STX_RS485_UART_RX (out), SAM_STX_RS485_UART_TX (in), STX_RS485_A (bidir), STX_RS485_B (bidir)

### Notes on the sheet
- Project:
- Sub-system:
- Design by:
- Sheet title:
- Sheet
- A3
- of
- Checked by:
- Approved by:
- Revision:
- Document No:
- Size:
- Date:

### Library data of the parts
C180#2 = _CAP_C_2: CAP
R226#2 R227#2 R228#2 = _RES_B_2: RES
U22#2 = MAX3485CSA+T: Low-Power, Slew-Rate-Limited RS-485/RS-422 Transceivers, IC TRANSCEIVER HALF 1/1 8SOIC; Manufacturer_Name: Analog Devices Inc; Manufacturer_Part_Number: MAX485CSA+T; Copyright: Copyright (C) 2025 Ultra Librarian. All rights reserved.; RefDes: RefDes; Type: Type

## Sheet RS422.SchDoc
size 420 x 297 mm; SheetNumber: 25; SheetTotal: 32
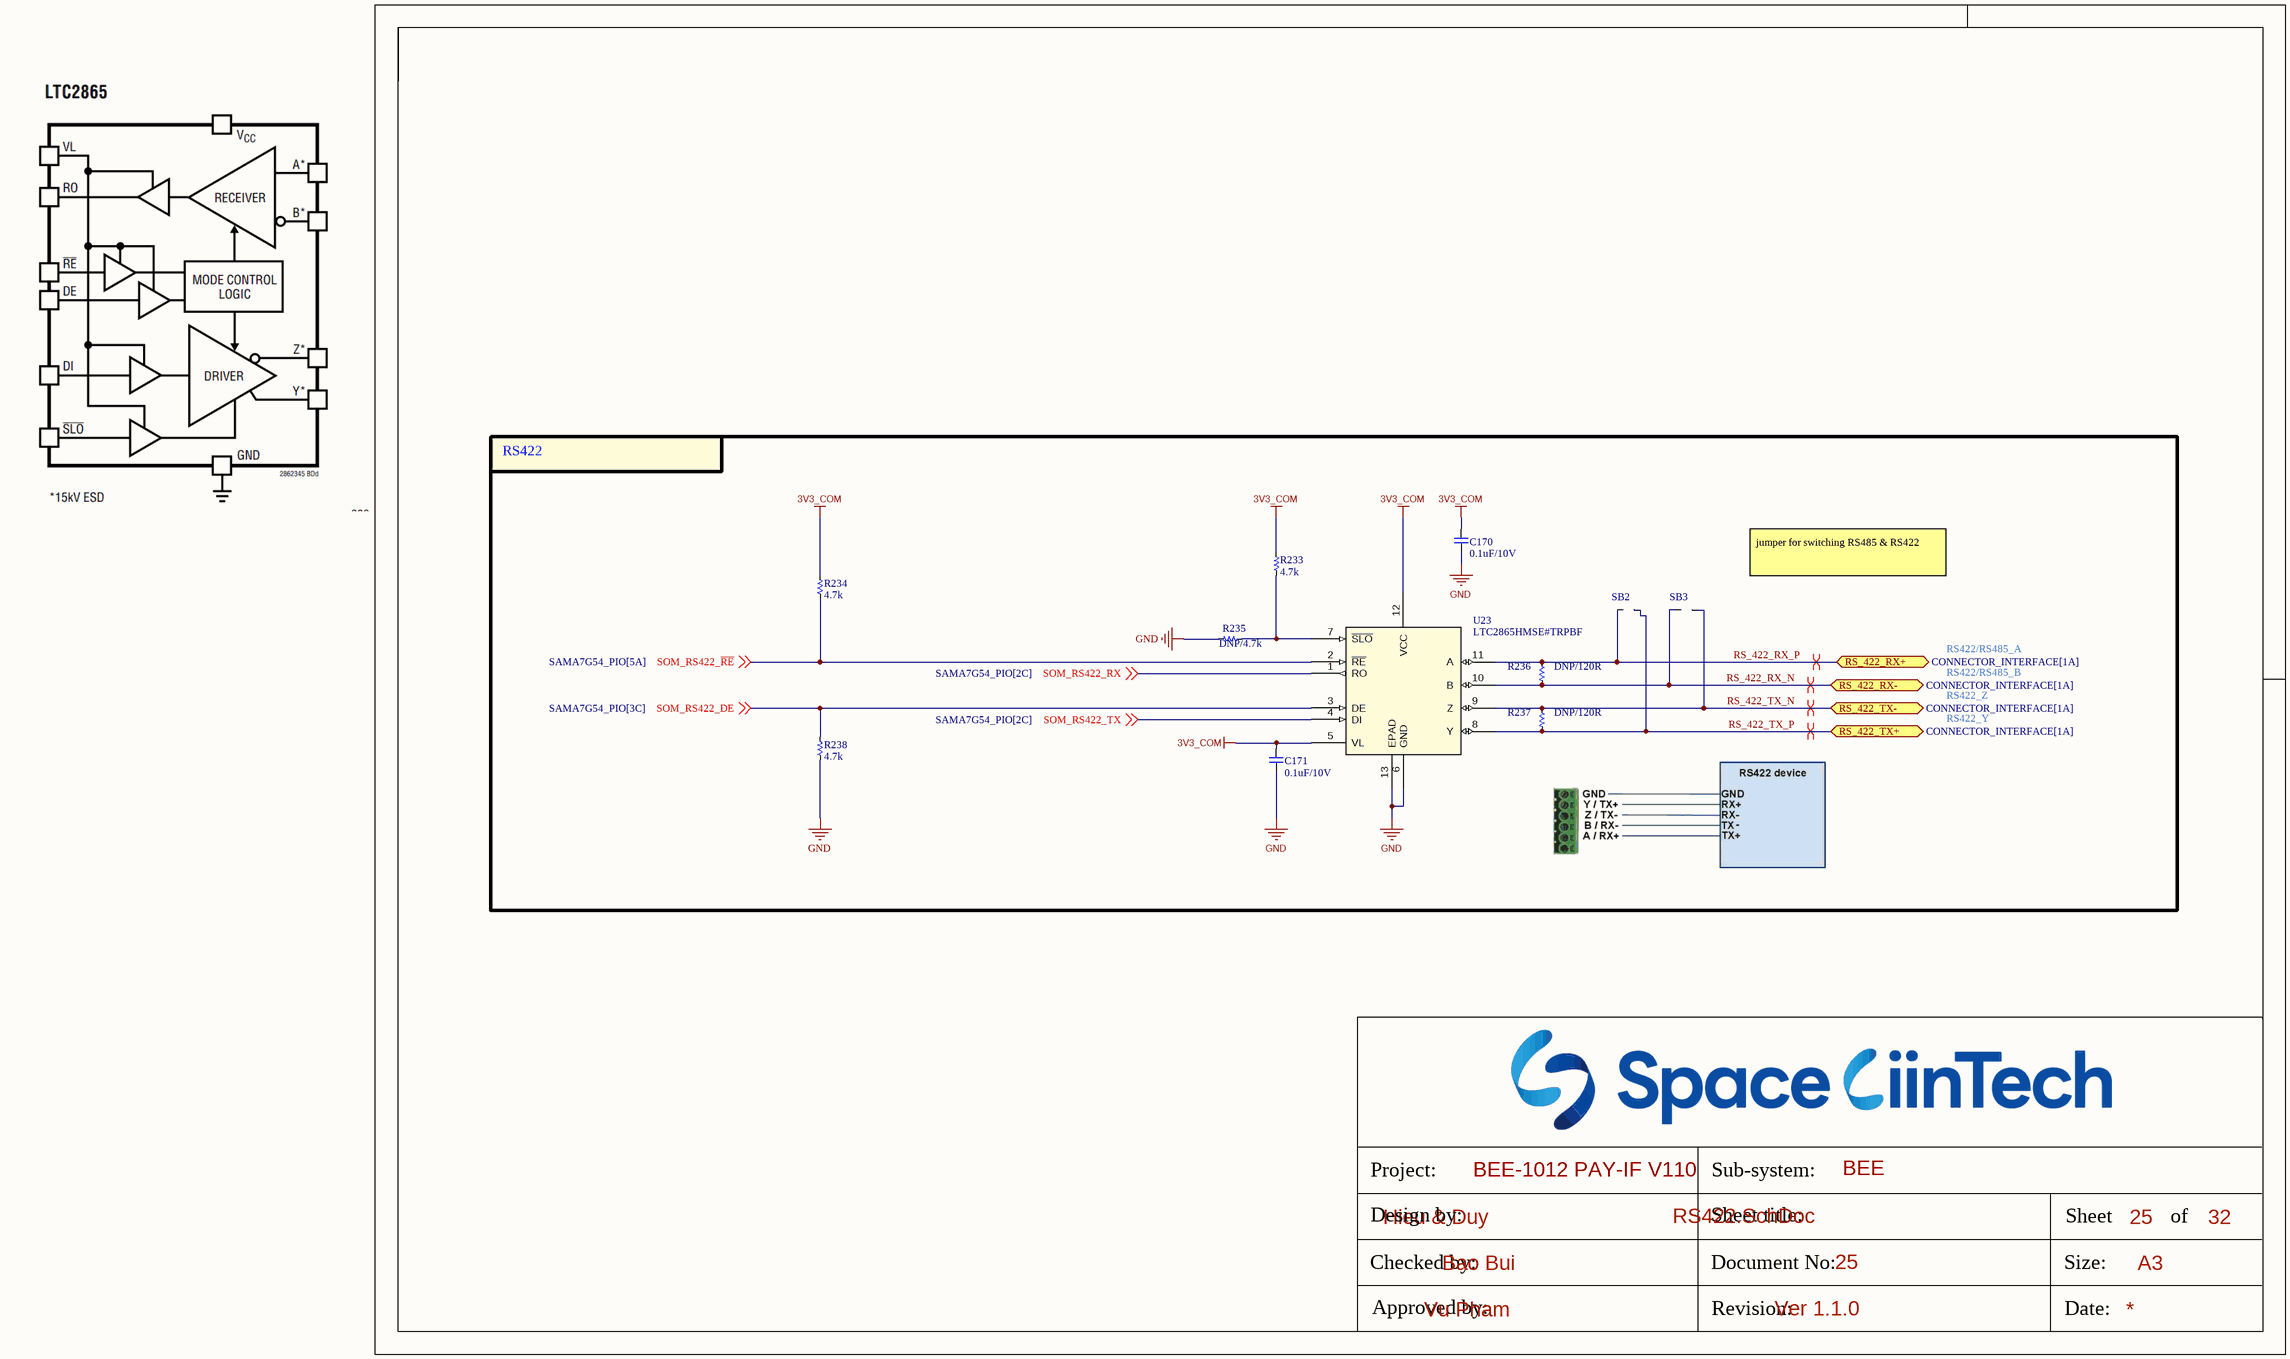
[diagram p27: RS422.SchDoc]

### Parts
C170  0.1uF/10V  [CAP_C_1005X50_L]
C171  0.1uF/10V  [CAP_C_1005X50_L]
R233  4.7k  [RES_C_1005x30_L]
R234  4.7k  [RES_C_1005x30_L]
R235  DNP/4.7k  [RES_C_1005x30_L]
R236  DNP/120R  [RES_C_1005x30_L]
R237  DNP/120R  [RES_C_1005x30_L]
R238  4.7k  [RES_C_1005x30_L]
SB2  JUMPER  [JUMPER_1608]  (value not drawn)
SB3  JUMPER  [JUMPER_1608]  (value not drawn)
U23  LTC2865HMSE#TRPBF  [MSOP-12_MSE_LIT]

### Ports
RS_422_RX+ (bidir, see CONNECTOR_INTERFACE[1A]), RS_422_RX- (bidir, see CONNECTOR_INTERFACE[1A]), RS_422_TX+ (bidir, see CONNECTOR_INTERFACE[1A]), RS_422_TX- (bidir, see CONNECTOR_INTERFACE[1A])

### Nets
3V3_COM: C170.2 C171.2 R233.2 R234.2 U23.5(VL) U23.12(VCC)
GND: C170.1 C171.1 R235.2 R238.1 U23.6(GND) U23.13(EPAD)
RS_422_RX_N: R236.2 SB3.1 U23.10(B) ; port RS_422_RX-
RS_422_RX_P: R236.1 SB2.1 U23.11(A) ; port RS_422_RX+
RS_422_TX_N: R237.1 SB3.2 U23.9(Z) ; port RS_422_TX-
RS_422_TX_P: R237.2 SB2.2 U23.8(Y) ; port RS_422_TX+
SOM_RS422_DE: R238.2 U23.3(DE) ; off-sheet SOM_RS422_DE
SOM_RS422_~{RE}: R234.1 U23.2(~{RE}) ; off-sheet SOM_RS422_~{RE}
SOM_RS422_RX: U23.1(RO) ; off-sheet SOM_RS422_RX
SOM_RS422_TX: U23.4(DI) ; off-sheet SOM_RS422_TX
NetR233_1: R233.1 R235.1 U23.7(~{SLO})

### Layout directives
differential pair: RS_422_RX_N, RS_422_RX_P, RS_422_TX_N, RS_422_TX_P

### Notes on the sheet
- RS422
- jumper for switching RS485 & RS422
- RS422/RS485_A
- RS422/RS485_B
- RS422_Z
- RS422_Y
- Project:
- Sub-system:
- Design by:
- Sheet title:
- Sheet
- A3
- of
- Checked by:
- Approved by:
- Revision:
- Document No:
- Size:
- Date:

### Library data of the parts
C170 C171 = _CAP_C_2: CAP
R233-R238 = _RES_B_2: RES
U23 = LTC2865HMSETRPBF: Â±60V Fault Protected 3V to 5.5V RS485/RS422 Transceivers; Manufacturer_Name: Analog Devices Inc; Copyright: Copyright (C) 2025 Ultra Librarian. All rights reserved.; Manufacturer_Part_Number: LTC2865HMSE#TRPBF; RefDes: RefDes; Type: Type

## Sheet BUTTON_LED.SchDoc
size 420 x 297 mm; SheetNumber: 26; SheetTotal: 32
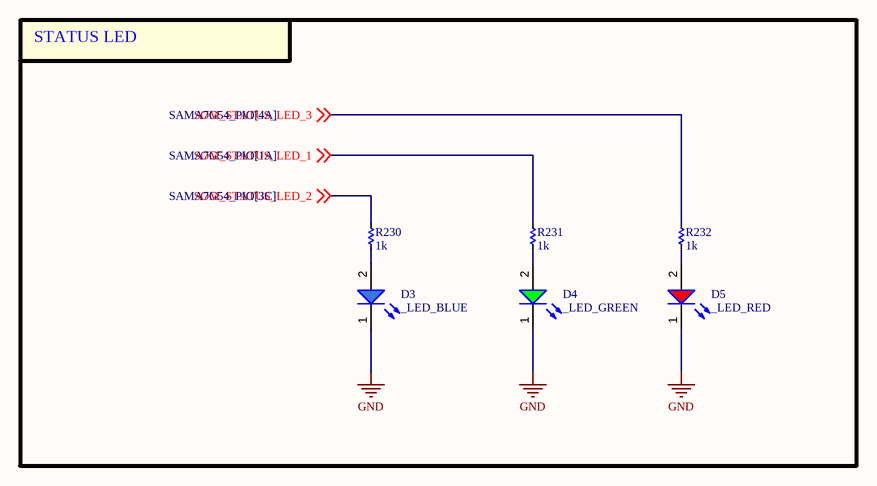
[diagram p28: BUTTON_LED.SchDoc]

### Parts
D3  _LED_BLUE  [LED_0603]
D4  _LED_GREEN  [LED_0603]
D5  _LED_RED  [LED_0603]
R230  1k  [RES_C_1005x30_L]
R231  1k  [RES_C_1005x30_L]
R232  1k  [RES_C_1005x30_L]

### Blocks framed on the sheet
STATUS LED: D3-D5 R230-R232

### Nets
GND: D3.1(K) D4.1(K) D5.1(K)
SOM_STATUS_LED_1: R231.2 ; off-sheet SOM_STATUS_LED_1
SOM_STATUS_LED_2: R230.2 ; off-sheet SOM_STATUS_LED_2
SOM_STATUS_LED_3: R232.2 ; off-sheet SOM_STATUS_LED_3
NetD3_2: D3.2(A) R230.1
NetD4_2: D4.2(A) R231.1
NetD5_2: D5.2(A) R232.1

### Notes on the sheet
- Project:
- Sub-system:
- Design by:
- Sheet title:
- Sheet
- A3
- of
- Checked by:
- Approved by:
- Revision:
- Document No:
- Size:
- Date:

### Library data of the parts
D3 = LED_BLUE: LED BLUE CLEAR 0603 SMD
D4 = LED_GREEN: LED GREEN CLEAR 0603 SMD
D5 = LED_RED: LED RED CLEAR 0603 SMD
R230-R232 = _RES_B_2: RES

## Sheet MOUNTING_HOLE.SchDoc
size 420 x 297 mm; SheetNumber: 27; SheetTotal: 32
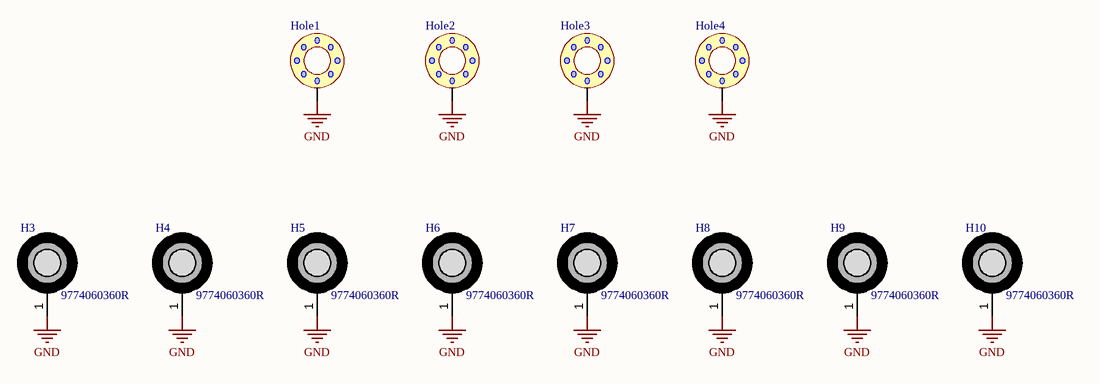
[diagram p29: MOUNTING_HOLE.SchDoc]

### Parts
H3  9774060360R  [M4.4]
H4  9774060360R  [M4.4]
H5  9774060360R  [M4.4]
H6  9774060360R  [M4.4]
H7  9774060360R  [M4.4]
H8  9774060360R  [M4.4]
H9  9774060360R  [M4.4]
H10  9774060360R  [M4.4]
Hole1  hole_space  [HEX-M3_NoVia]  (value not drawn)
Hole2  hole_space  [HEX-M3_NoVia]  (value not drawn)
Hole3  hole_space  [HEX-M3_NoVia]  (value not drawn)
Hole4  hole_space  [HEX-M3_NoVia]  (value not drawn)

### Nets
GND: H3.1 H4.1 H5.1 H6.1 H7.1 H8.1 H9.1 H10.1 Hole1.1 Hole2.1 Hole3.1 Hole4.1

### Notes on the sheet
- Project:
- Sub-system:
- Design by:
- Sheet title:
- Sheet
- A3
- of
- Checked by:
- Approved by:
- Revision:
- Document No:
- Size:
- Date:

### Library data of the parts
H3-H10 = M4.4: WA-SMSI SMT Steel Spacer with / internal Thread

## Sheet FPGA_POWER.SchDoc
size 420 x 297 mm; SheetNumber: 28; SheetTotal: 32
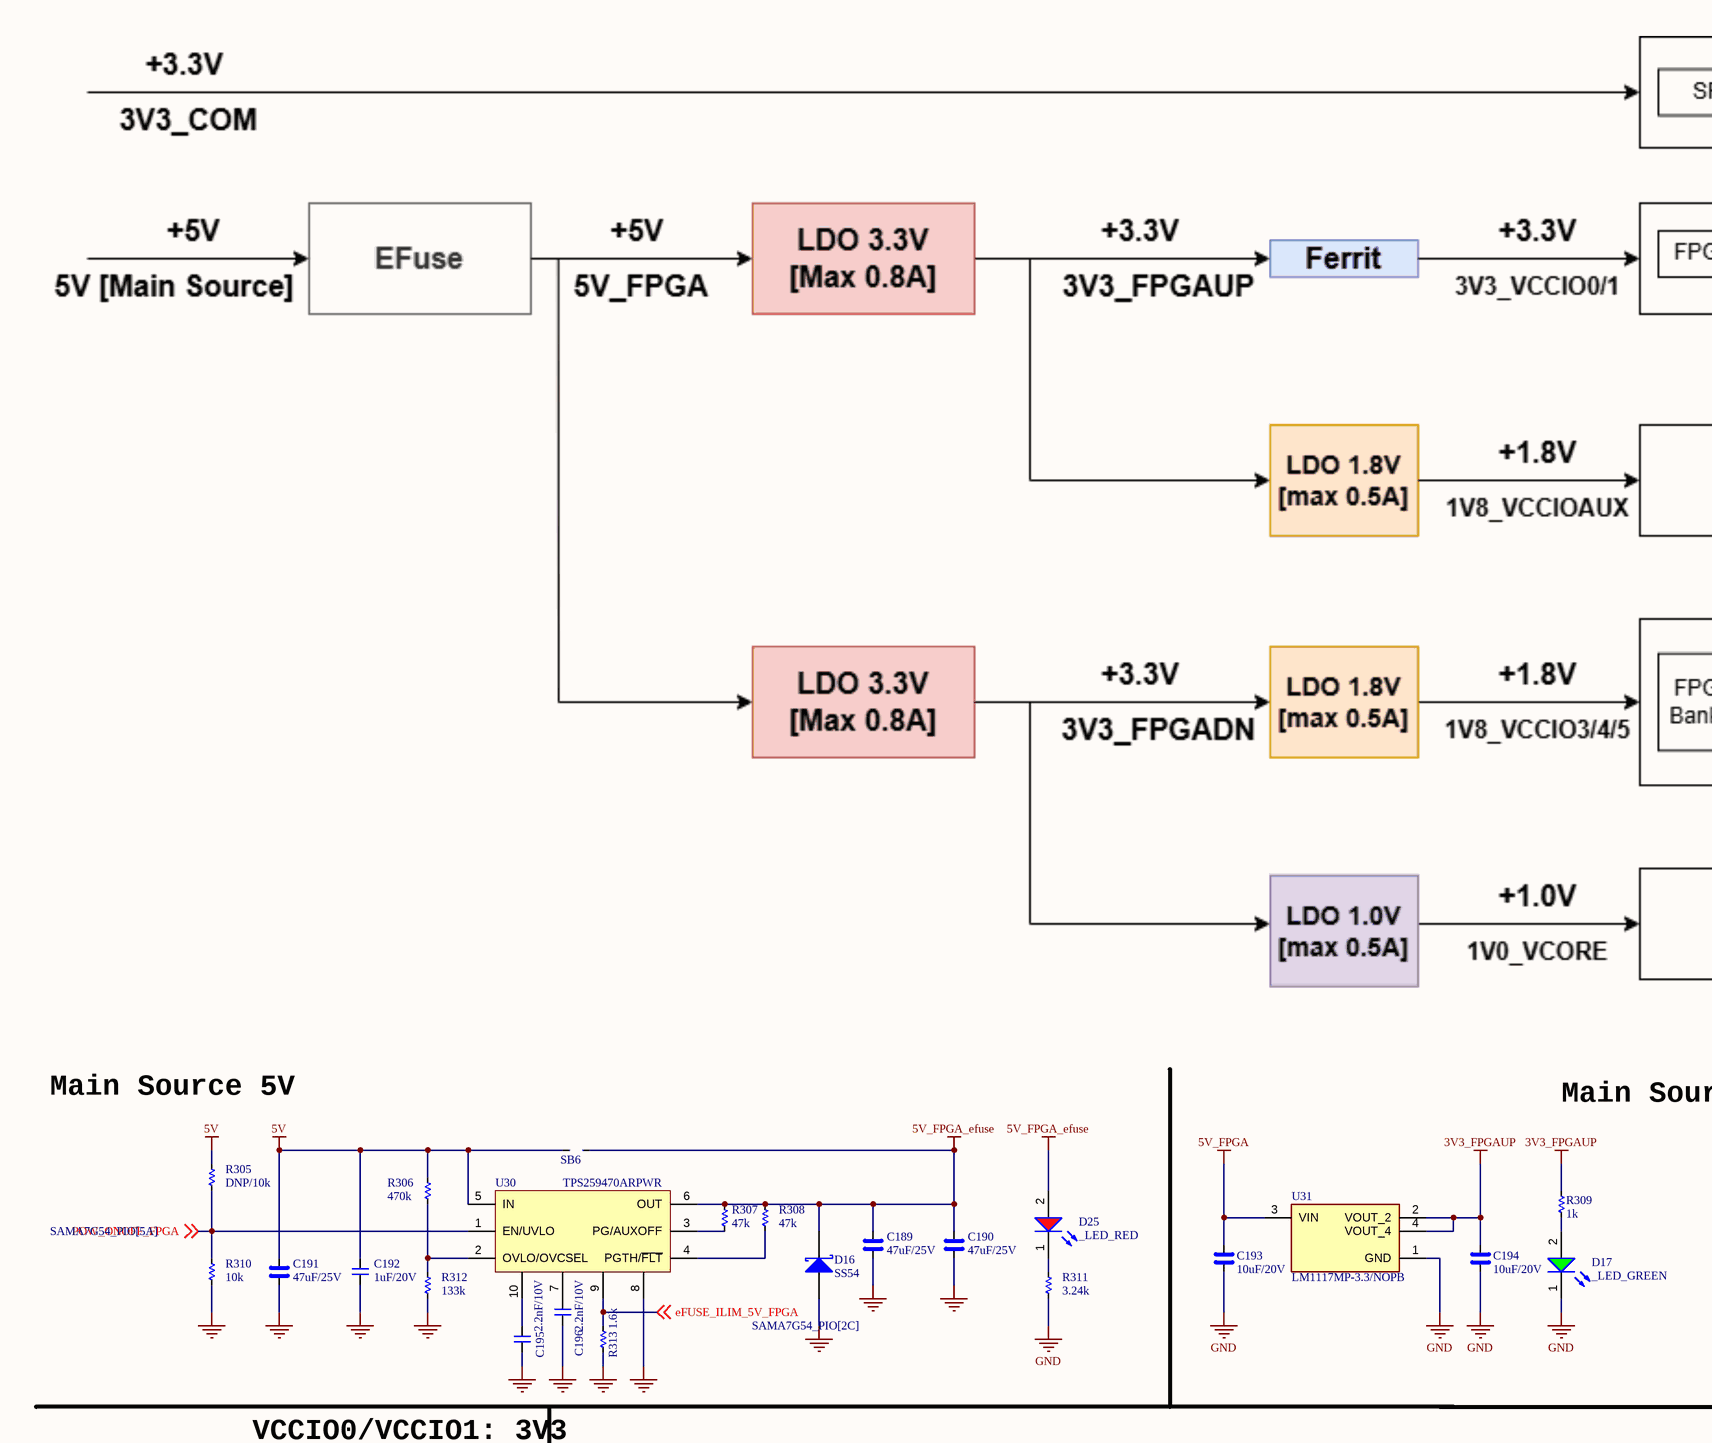
[diagram p30: FPGA_POWER.SchDoc, top left]
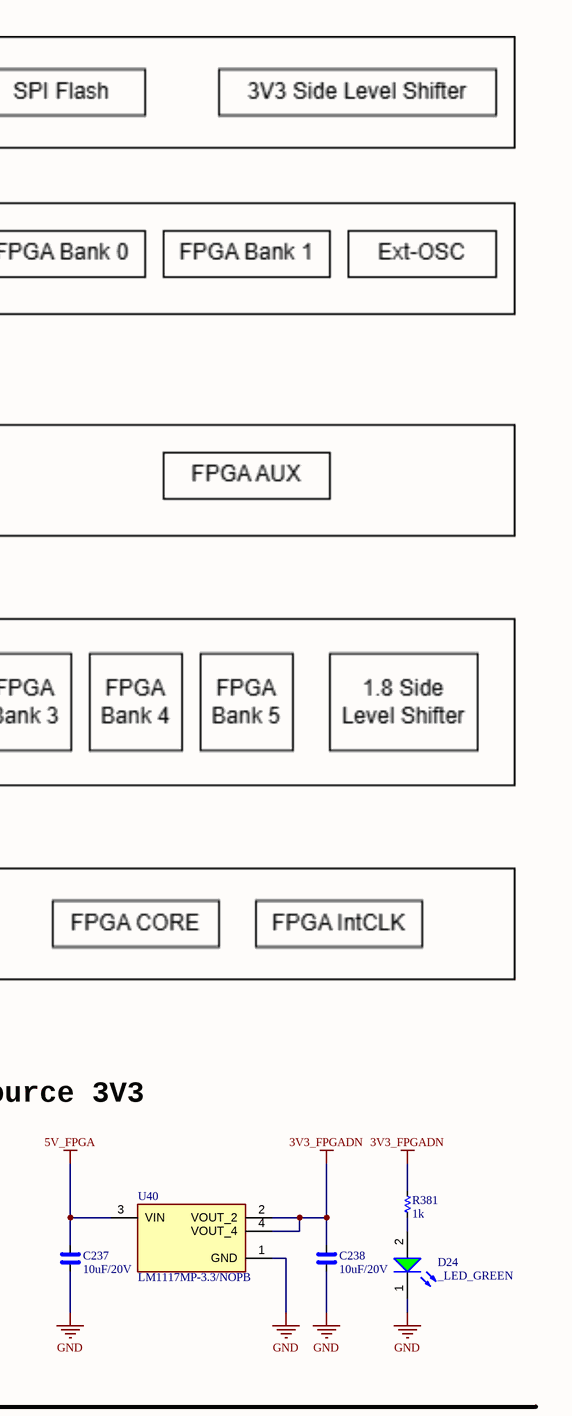
[diagram p31: FPGA_POWER.SchDoc, top right]
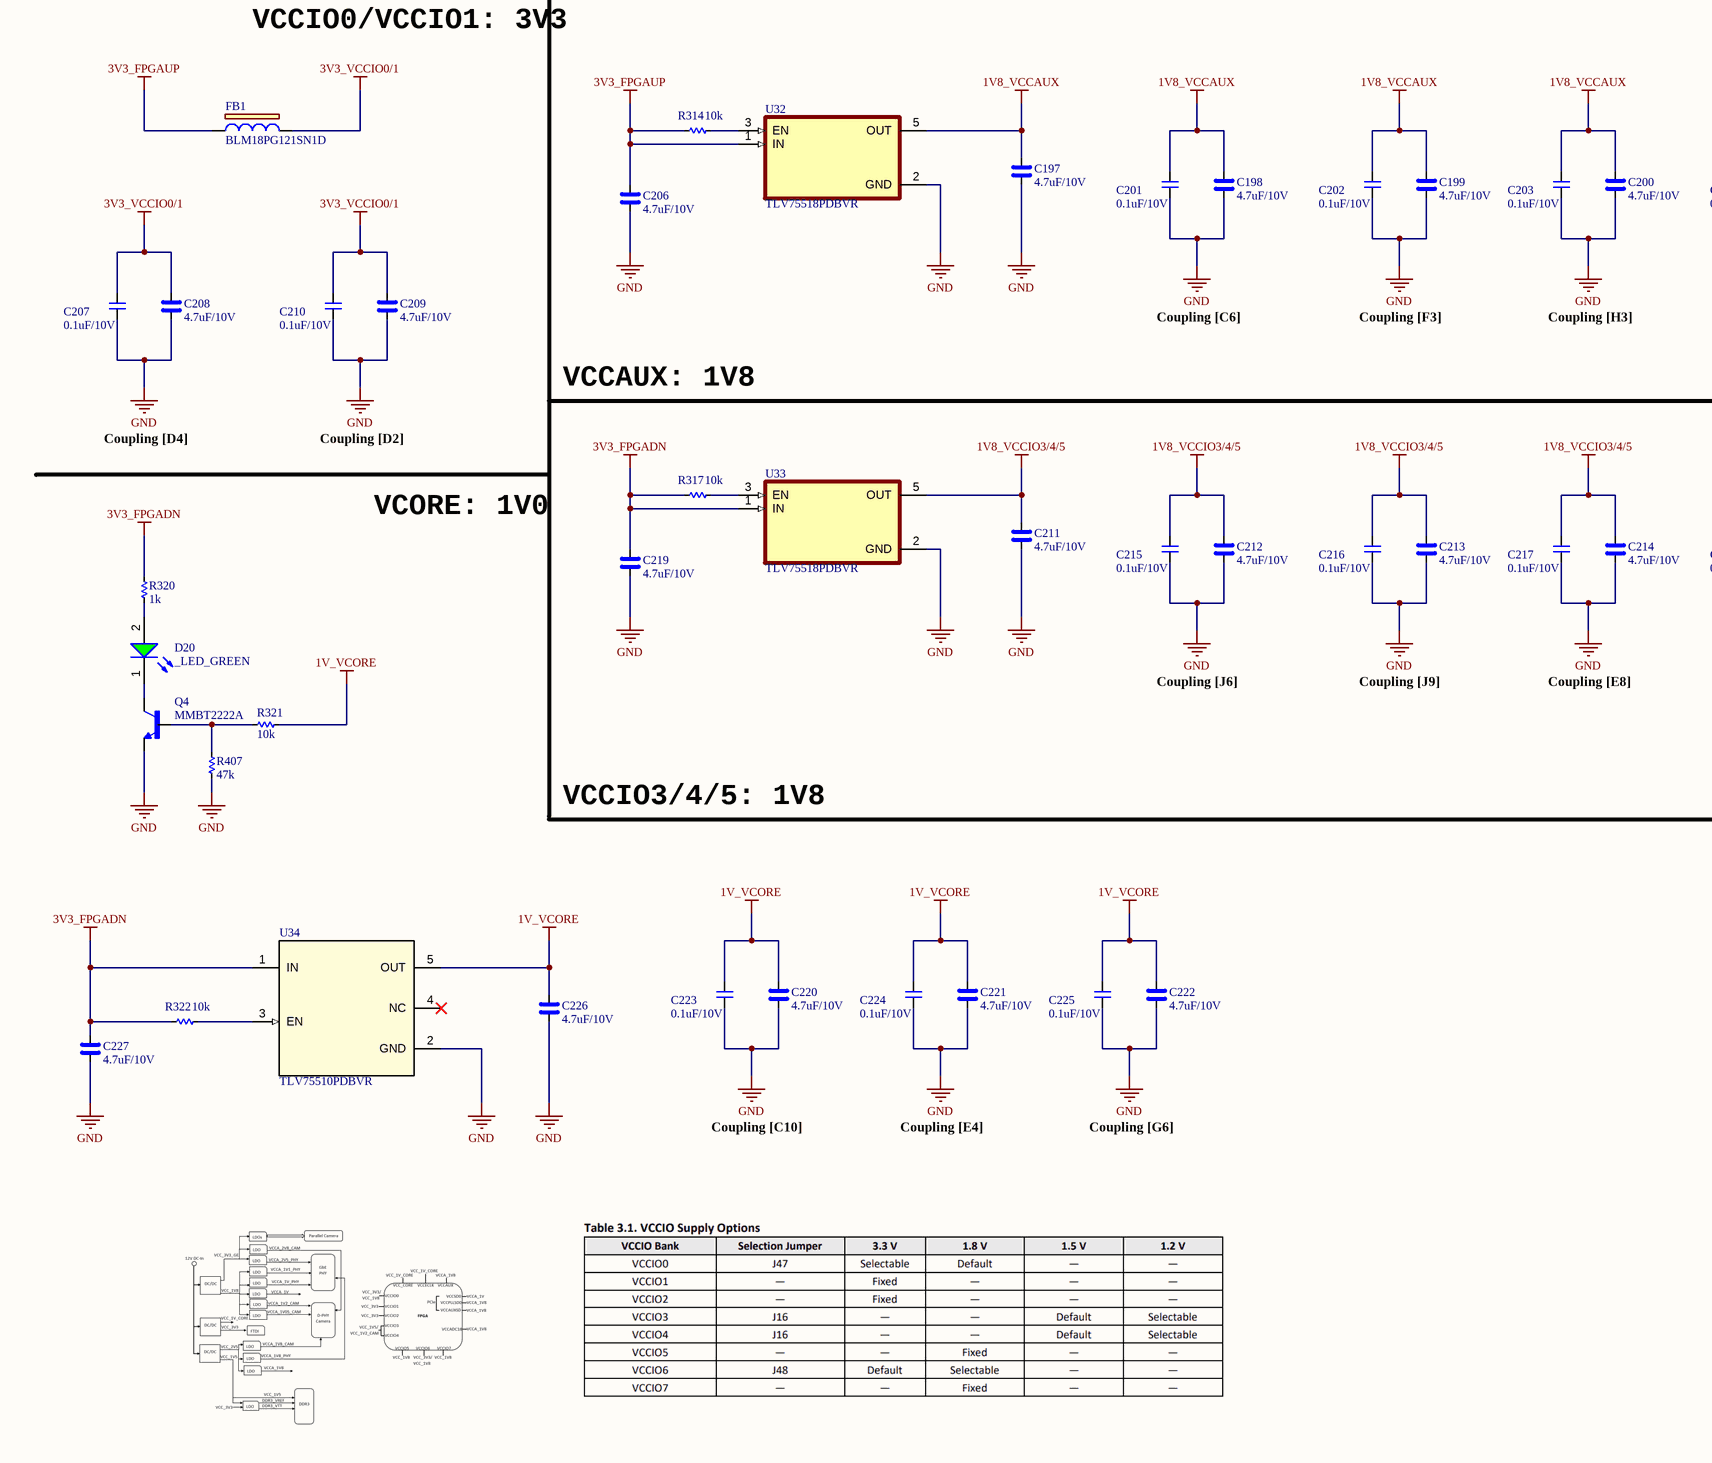
[diagram p32: FPGA_POWER.SchDoc, bottom left]
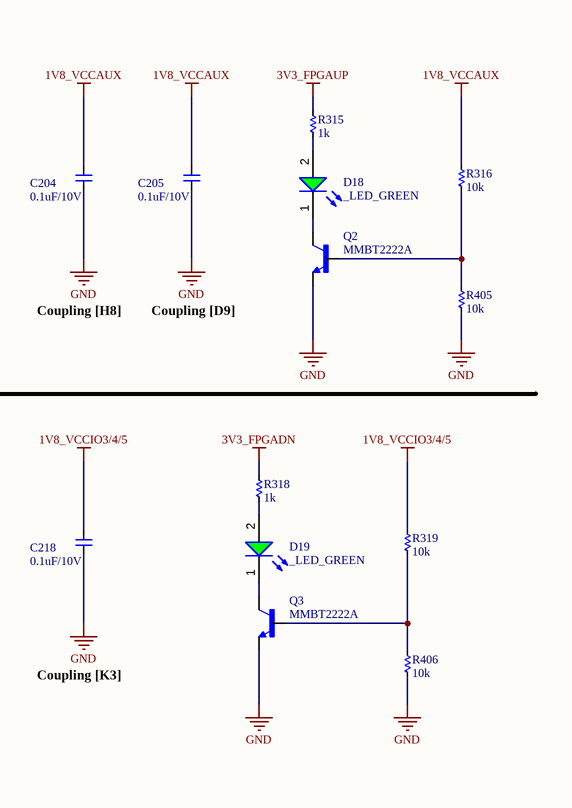
[diagram p33: FPGA_POWER.SchDoc, bottom right]

### Parts
(Parts that share a designator on the sheet are numbered #1, #2 ... from top to bottom, then left to right.)
C189  47uF/25V  [CAP_C_3225X80]
C190  47uF/25V  [CAP_C_3225X80]
C191  47uF/25V  [CAP_C_3225X80]
C192  1uF/20V  [CAP_C_1005X50_L]
C193  10uF/20V  [CAP_C_1608X80_L]
C194  10uF/20V  [CAP_C_1608X80_L]
C195  2.2nF/10V  [CAP_C_1005X50_L]
C196  2.2nF/10V  [CAP_C_1005X50_L]
C197  4.7uF/10V  [CAP_C_2012X110]
C198  4.7uF/10V  [CAP_C_1005X50_L]
C199  4.7uF/10V  [CAP_C_1005X50_L]
C200  4.7uF/10V  [CAP_C_1005X50_L]
C201  0.1uF/10V  [CAP_C_0603x30]
C202  0.1uF/10V  [CAP_C_0603x30]
C203  0.1uF/10V  [CAP_C_0603x30]
C204  0.1uF/10V  [CAP_C_0603x30]
C205  0.1uF/10V  [CAP_C_0603x30]
C206  4.7uF/10V  [CAP_C_2012X110]
C207  0.1uF/10V  [CAP_C_0603x30]
C208  4.7uF/10V  [CAP_C_1005X50_L]
C209  4.7uF/10V  [CAP_C_1005X50_L]
C210  0.1uF/10V  [CAP_C_0603x30]
C211  4.7uF/10V  [CAP_C_2012X110]
C212  4.7uF/10V  [CAP_C_1005X50_L]
C213  4.7uF/10V  [CAP_C_1005X50_L]
C214  4.7uF/10V  [CAP_C_1005X50_L]
C215  0.1uF/10V  [CAP_C_0603x30]
C216  0.1uF/10V  [CAP_C_0603x30]
C217  0.1uF/10V  [CAP_C_0603x30]
C218  0.1uF/10V  [CAP_C_0603x30]
C219  4.7uF/10V  [CAP_C_2012X110]
C220  4.7uF/10V  [CAP_C_1005X50_L]
C221  4.7uF/10V  [CAP_C_1005X50_L]
C222  4.7uF/10V  [CAP_C_1005X50_L]
C223  0.1uF/10V  [CAP_C_0603x30]
C224  0.1uF/10V  [CAP_C_0603x30]
C225  0.1uF/10V  [CAP_C_0603x30]
C226  4.7uF/10V  [CAP_C_2012X110]
C227  4.7uF/10V  [CAP_C_2012X110]
C237  10uF/20V  [CAP_C_1608X80_L]
C238  10uF/20V  [CAP_C_1608X80_L]
D16  SS54  [DO-214AC_SMA]
D17  _LED_GREEN  [LED_0603]
D18  _LED_GREEN  [LED_0603]
D19  _LED_GREEN  [LED_0603]
D20  _LED_GREEN  [LED_0603]
D24  _LED_GREEN  [LED_0603]
D25  _LED_RED  [LED_0603]
FB1#2  BLM18PG121SN1D  [IND_C_1608X60]
Q2  MMBT2222A  [SOT95P240X120-3N]
Q3#2  MMBT2222A  [SOT95P240X120-3N]
Q4#2  MMBT2222A  [SOT95P240X120-3N]
R305  DNP/10k  [RES_C_1005x30_L]
R306  470k  [RES_C_1005x30_L]
R307  47k  [RES_C_1005x30_L]
R308  47k  [RES_C_1005x30_L]
R309  1k  [RES_C_1005x30_L]
R310  10k  [RES_C_1005x30_L]
R311  3.24k  [RES_C_1005x30_L]
R312  133k  [RES_C_1005x30_L]
R313  1.6k  [RES_C_1005x30_L]
R314  10k  [RES_C_1005x30_L]
R315  1k  [RES_C_1005x30_L]
R316  10k  [RES_C_1005x30_L]
R317  10k  [RES_C_1005x30_L]
R318  1k  [RES_C_1005x30_L]
R319  10k  [RES_C_1005x30_L]
R320  1k  [RES_C_1005x30_L]
R321  10k  [RES_C_1005x30_L]
R322  10k  [RES_C_1005x30_L]
R381  1k  [RES_C_1005x30_L]
R405  10k  [RES_C_1005x30_L]
R406  10k  [RES_C_1005x30_L]
R407  47k  [RES_C_1005x30_L]
SB6  JUMPER  [JUMPER_1608]  (value not drawn)
U30  TPS259470ARPWR  [VQFN-HR-10]
U31  LM1117MP-3.3/NOPB  [VREG_LM1117MP-3.3/NOPB]
U32  TLV75518PDBVR  [DBV0005A_N]
U33  TLV75518PDBVR  [DBV0005A_N]
U34  TLV75510PDBVR  [DBV0005A_N]
U40  LM1117MP-3.3/NOPB  [VREG_LM1117MP-3.3/NOPB]

### Nets
1V8_VCCAUX: C197.2 C198.2 C199.2 C200.2 C201.2 C202.2 C203.2 C204.2 C205.2 R316.1 U32.5(OUT)
1V8_VCCIO3/4/5: C211.2 C212.2 C213.2 C214.2 C215.2 C216.2 C217.2 C218.2 R319.1 U33.5(OUT)
1V_VCORE: C220.2 C221.2 C222.2 C223.2 C224.2 C225.2 C226.2 R321.1 U34.5(OUT)
3V3_FPGADN: C219.2 C227.2 C238.2 R317.1 R318.2 R320.2 R322.1 R381.2 U33.1(IN) U34.1(IN) U40.2(VOUT_2) U40.4(VOUT_4)
3V3_FPGAUP: C194.2 C206.2 FB1#2.2 R309.2 R314.1 R315.2 U31.2(VOUT_2) U31.4(VOUT_4) U32.1(IN)
3V3_VCCIO0/1: C207.2 C208.2 C209.2 C210.2 FB1#2.1
5V: C191.2 C192.2 R305.1 R306.2 SB6.1 U30.5(IN)
5V_FPGA: C193.2 C237.2 U31.3(VIN) U40.3(VIN)
5V_FPGA_efuse: C189.2 C190.2 D16.1(K) D25.2(A) R307.2 R308.2 SB6.2 U30.6(OUT)
GND: C189.1 C190.1 C191.1 C192.1 C193.1 C194.1 C195.1 C196.1 C197.1 C198.1 C199.1 C200.1 C201.1 C202.1 C203.1 C204.1 C205.1 C206.1 C207.1 C208.1 C209.1 C210.1 C211.1 C212.1 C213.1 C214.1 C215.1 C216.1 C217.1 C218.1 C219.1 C220.1 C221.1 C222.1 C223.1 C224.1 C225.1 C226.1 C227.1 C237.1 C238.1 D16.2(A) D17.1(K) D24.1(K) Q2.2(E) Q3#2.2(E) Q4#2.2(E) R310.2 R311.1 R312.1 R313.1 R405.2 R406.2 R407.1 U30.8 U31.1(GND) U32.2(GND) U33.2(GND) U34.2(GND) U40.1(GND)
eFUSE_ILIM_5V_FPGA: R313.2 U30.9 ; off-sheet eFUSE_ILIM_5V_FPGA
POW_ONOFF_FPGA: R305.2 R310.1 U30.1(EN/UVLO) ; off-sheet POW_ONOFF_FPGA
NetC195_2: C195.2 U30.10
NetC196_2: C196.2 U30.7
NetD17_2: D17.2(A) R309.1
NetD18_1: D18.1(K) Q2.3(C)
NetD18_2: D18.2(A) R315.1
NetD19_1: D19.1(K) Q3#2.3(C)
NetD19_2: D19.2(A) R318.1
NetD20_1: D20.1(K) Q4#2.3(C)
NetD20_2: D20.2(A) R320.1
NetD24_2: D24.2(A) R381.1
NetD25_1: D25.1(K) R311.2
NetQ2_1: Q2.1(B) R316.2 R405.1
NetQ3#2_1: Q3#2.1(B) R319.2 R406.1
NetQ4#2_1: Q4#2.1(B) R321.2 R407.2
NetR306_1: R306.1 R312.2 U30.2(OVLO/OVCSEL)
NetR307_1: R307.1 U30.3(PG/AUXOFF)
NetR308_1: R308.1 U30.4(PGTH/~{FLT})
NetR314_2: R314.2 U32.3(EN)
NetR317_2: R317.2 U33.3(EN)
NetR322_2: R322.2 U34.3(EN)

Not connected (* = marked no-connect by the designer): U34 4(NC)*

### Notes on the sheet
- Main Source 5V
- Main Source 3V3
- VCCIO0/VCCIO1: 3V3
- Coupling [C6]
- Coupling [F3]
- Coupling [H3]
- Coupling [H8]
- Coupling [D9]
- VCCAUX: 1V8
- Coupling [D4]
- Coupling [D2]
- VCORE: 1V0
- Coupling [J6]
- Coupling [J9]
- Coupling [E8]
- Coupling [K3]
- VCCIO3/4/5: 1V8
- Coupling [C10]
- Coupling [E4]
- Coupling [G6]
- Project:
- Sub-system:
- Design by:
- Sheet title:
- Sheet
- A3
- of
- Checked by:
- Approved by:
- Revision:
- Document No:
- Size:
- Date:

### Library data of the parts
C189-C191 C193 C194 C197 C206 C211 C219 C226 C227 C237 C238 = _CAP_C_High_2: CAP CHIP High Value
C192 C195 C196 = _CAP_C_2: CAP CHIP
C198-C200 C208 C209 C212-C214 C220-C222 = _CAP_C_High_2: CAP
C201-C205 C207 C210 C215-C218 C223-C225 = _CAP_C_2: CAP
D16 = SS54: DIODE SCHOTTKY 40V 5A SMA; MPN: SS34; Solder: SMT; Value: SS34; MFR: *
D17-D20 D24 = LED_GREEN: LED GREEN CLEAR 0603 SMD
D25 = LED_RED: LED RED CLEAR 0603 SMD
FB1#2 = BLM18PG121SN1D: FERRITE BEAD 120 OHM 0603 1LN; Manufacturer_Name: Murata; Copyright: Copyright (C) 2025 Ultra Librarian. All rights reserved.; Manufacturer_Part_Number: BLM18PG121SN1D
Q2 Q3#2 Q4#2 = BJT_NPN_BEC: MF: Diotec Semiconductor; SnapEDA_Link: https://www.snapeda.com/parts/MMBT2222A/Diotec/view-part/?ref=snap; Package: SOT-23 Diotec; Value: *; MP: MMBT2222A; Check_prices: https://www.snapeda.com/parts/MMBT2222A/Diotec/view-part/?ref=eda
R305-R322 R381 R405-R407 = _RES_B_2: RES
U31 U40 = LM1117MP-3.3/NOPB: 800-mA 15-V linear voltage regulator; MF: Texas Instruments; SnapEDA_Link: https://www.snapeda.com/parts/LM1117MP-3.3/NOPB/Texas+Instruments/view-part/?ref=snap; Package: SOT-223-4 Texas Instruments; Value: *; MP: LM1117MP-3.3/NOPB; Check_prices: https://www.snapeda.com/parts/LM1117MP-3.3/NOPB/Texas+Instruments/view-part/?ref=eda
U32 U33 = TLV75518PDBVR: 500-mA high-PSRR low-IQ low-dropout voltage regulator with enable; MF: Texas Instruments; SnapEDA_Link: https://www.snapeda.com/parts/TLV75518PDBVR/Texas+Instruments/view-part/?ref=snap; Package: SOT-23-5 Texas Instruments; Value: *; MP: TLV75518PDBVR; Check_prices: https://www.snapeda.com/parts/TLV75518PDBVR/Texas+Instruments/view-part/?ref=eda
U34 = TLV75510PDBVR: 500mA high-PSRR low-I<sub>Q</sub> low-dropout voltage regulator with enable 5-SOT-23 -40 to 125; Manufacturer_Name: Texas Instruments; TYPE: TYPE; RefDes: RefDes; Copyright: Copyright (C) 2025 Ultra Librarian. All rights reserved.; Manufacturer_Part_Number: TLV75510PDBVR

## Sheet FPGA_PART1.SchDoc
size 420 x 297 mm; SheetNumber: 29; SheetTotal: 32
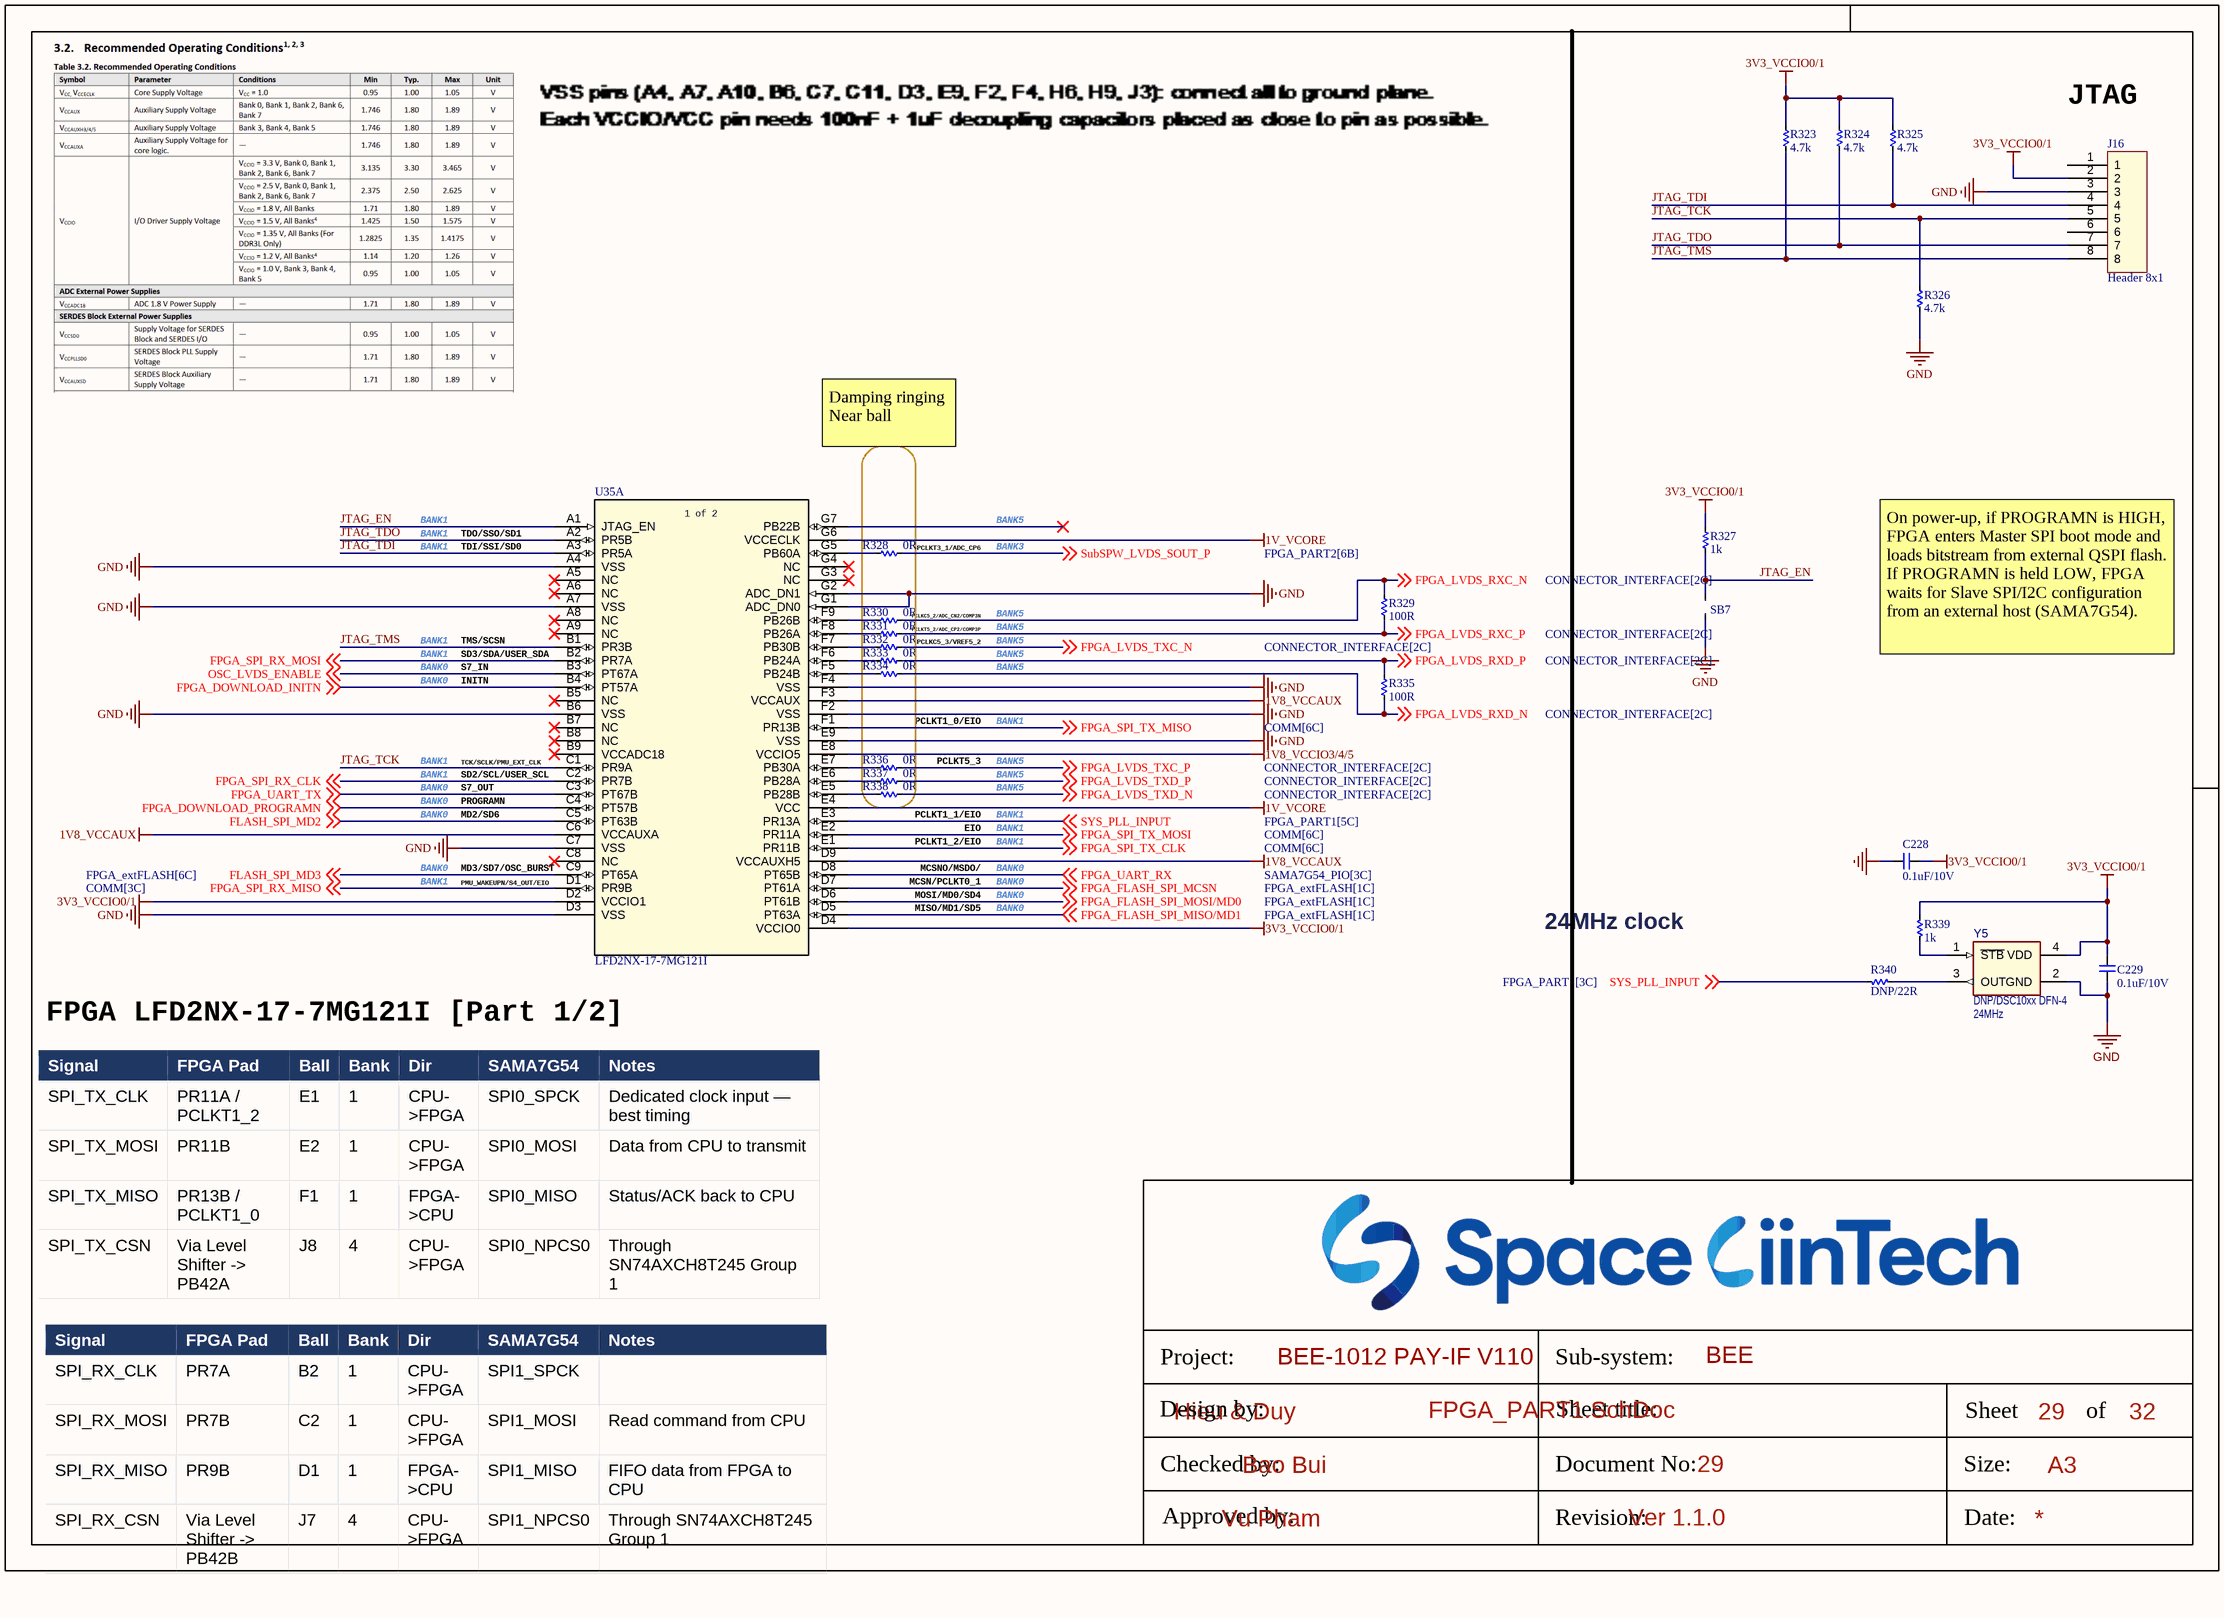
[diagram p34: FPGA_PART1.SchDoc]

### Parts
C228  0.1uF/10V  [CAP_C_1005X50_L]
C229  0.1uF/10V  [CAP_C_1005X50_L]
J16  Header 8x1  [SAMTEC_TSM-108-01-L-SV-P-TR]
R323  4.7k  [RES_C_1005x30_L]
R324  4.7k  [RES_C_1005x30_L]
R325  4.7k  [RES_C_1005x30_L]
R326  4.7k  [RES_C_1005x30_L]
R327  1k  [RES_C_1005x30_L]
R328  0R  [RES_C_1005x30_L]
R329  100R  [RES_C_1005x30_L]
R330  0R  [RES_C_1005x30_L]
R331  0R  [RES_C_1005x30_L]
R332  0R  [RES_C_1005x30_L]
R333  0R  [RES_C_1005x30_L]
R334  0R  [RES_C_1005x30_L]
R335  100R  [RES_C_1005x30_L]
R336  0R  [RES_C_1005x30_L]
R337  0R  [RES_C_1005x30_L]
R338  0R  [RES_C_1005x30_L]
R339  1k  [RES_C_1005x30_L]
R340  DNP/22R  [RES_C_1005x30_L]
SB7  JUMPER  [JUMPER_1608]  (value not drawn)
U35  LFD2NX-17-7MG121I  [csfBGA121_LAT]  (part A of 2)
Y5  DNP/DSC10xx DFN-4  value 24MHz  [DFN-4_2.5x2]

### Nets
1V8_VCCAUX: U35.C6(VCCAUXA) U35.D9(VCCAUXH5) U35.F3(VCCAUX)
1V8_VCCIO3/4/5: U35.E8(VCCIO5)
1V_VCORE: U35.E4(VCC) U35.G6(VCCECLK)
3V3_VCCIO0/1: C228.2 C229.2 J16.2 R323.2 R324.2 R325.2 R327.2 R339.2 U35.D2(VCCIO1) U35.D4(VCCIO0) Y5.4(VDD)
GND: C228.1 C229.1 J16.3 R326.1 SB7.1 U35.A4(VSS) U35.A7(VSS) U35.B6(VSS) U35.C7(VSS) U35.D3(VSS) U35.E9(VSS) U35.F2(VSS) U35.F4(VSS) U35.G1(ADC_DN0) U35.G2(ADC_DN1) Y5.2(GND)
FLASH_SPI_MD2: U35.C5(PT63B) ; off-sheet FLASH_SPI_MD2
FLASH_SPI_MD3: U35.C9(PT65A) ; off-sheet FLASH_SPI_MD3
FPGA_DOWNLOAD_INITN: U35.B4(PT57A) ; off-sheet FPGA_DOWNLOAD_INITN
FPGA_DOWNLOAD_PROGRAMN: U35.C4(PT57B) ; off-sheet FPGA_DOWNLOAD_PROGRAMN
FPGA_FLASH_SPI_MCSN: U35.D7(PT61A) ; off-sheet FPGA_FLASH_SPI_MCSN
FPGA_FLASH_SPI_MISO/MD1: U35.D5(PT63A) ; off-sheet FPGA_FLASH_SPI_MISO/MD1
FPGA_FLASH_SPI_MOSI/MD0: U35.D6(PT61B) ; off-sheet FPGA_FLASH_SPI_MOSI/MD0
FPGA_LVDS_RXC_N: R329.1 R330.1 ; off-sheet FPGA_LVDS_RXC_N
FPGA_LVDS_RXC_P: R329.2 R331.1 ; off-sheet FPGA_LVDS_RXC_P
FPGA_LVDS_RXD_N: R334.1 R335.2 ; off-sheet FPGA_LVDS_RXD_N
FPGA_LVDS_RXD_P: R333.1 R335.1 ; off-sheet FPGA_LVDS_RXD_P
FPGA_LVDS_TXC_N: R332.1 ; off-sheet FPGA_LVDS_TXC_N
FPGA_LVDS_TXC_P: R336.1 ; off-sheet FPGA_LVDS_TXC_P
FPGA_LVDS_TXD_N: R338.1 ; off-sheet FPGA_LVDS_TXD_N
FPGA_LVDS_TXD_P: R337.1 ; off-sheet FPGA_LVDS_TXD_P
FPGA_SPI_RX_CLK: U35.C2(PR7B) ; off-sheet FPGA_SPI_RX_CLK
FPGA_SPI_RX_MISO: U35.D1(PR9B) ; off-sheet FPGA_SPI_RX_MISO
FPGA_SPI_RX_MOSI: U35.B2(PR7A) ; off-sheet FPGA_SPI_RX_MOSI
FPGA_SPI_TX_CLK: U35.E1(PR11B) ; off-sheet FPGA_SPI_TX_CLK
FPGA_SPI_TX_MISO: U35.F1(PR13B) ; off-sheet FPGA_SPI_TX_MISO
FPGA_SPI_TX_MOSI: U35.E2(PR11A) ; off-sheet FPGA_SPI_TX_MOSI
FPGA_UART_RX: U35.D8(PT65B) ; off-sheet FPGA_UART_RX
FPGA_UART_TX: U35.C3(PT67B) ; off-sheet FPGA_UART_TX
JTAG_EN: R327.1 SB7.2 U35.A1(JTAG_EN)
JTAG_TCK: J16.5 R326.2 U35.C1(PR9A)
JTAG_TDI: J16.4 R325.1 U35.A3(PR5A)
JTAG_TDO: J16.7 R324.1 U35.A2(PR5B)
JTAG_TMS: J16.8 R323.1 U35.B1(PR3B)
OSC_LVDS_ENABLE: U35.B3(PT67A) ; off-sheet OSC_LVDS_ENABLE
SubSPW_LVDS_SOUT_P: R328.1 ; off-sheet SubSPW_LVDS_SOUT_P
SYS_PLL_INPUT: R340.2 U35.E3(PR13A) ; off-sheet SYS_PLL_INPUT
NetR328_2: R328.2 U35.G5(PB60A)
NetR330_2: R330.2 U35.F9(PB26B)
NetR331_2: R331.2 U35.F8(PB26A)
NetR332_2: R332.2 U35.F7(PB30B)
NetR333_2: R333.2 U35.F6(PB24A)
NetR334_2: R334.2 U35.F5(PB24B)
NetR336_2: R336.2 U35.E7(PB30A)
NetR337_2: R337.2 U35.E6(PB28A)
NetR338_2: R338.2 U35.E5(PB28B)
NetR339_1: R339.1 Y5.1(~{STB})
NetR340_1: R340.1 Y5.3(OUT)

Not connected (* = marked no-connect by the designer): J16 1 6; U35 A5(NC)* A6(NC)* A8(NC)* A9(NC)* B5(NC)* B7(NC)* B8(NC)* B9(VCCADC18)* C8(NC)* G3(NC)* G4(NC)* G7(PB22B)*

### Notes on the sheet
- JTAG
- Damping ringing
  Near ball
- BANK1
- BANK5
- TDO/SSO/SD1
- TDI/SSI/SD0
- (near R328) PCLKT3_1/ADC_CP6
- BANK3
- TMS/SCSN
- SD3/SDA/USER_SDA
- PCLKC5_3/VREF5_2
- PCLKT5_2/ADC_CP2/COMP3P
- PCLKC5_2/ADC_CN2/COMP3N
- On power-up, if PROGRAMN is HIGH, FPGA enters Master SPI boot mode and loads bitstream from external QSPI flash. If PROGRAMN is held LOW, FPGA waits for Slave SPI/I2C configuration from an external host (SAMA7G54).
- BANK0
- S7_IN
- INITN
- PCLKT1_0/EIO
- TCK/SCLK/PMU_EXT_CLK
- SD2/SCL/USER_SCL
- S7_OUT
- PCLKT5_3
- PROGRAMN
- MD2/SD6
- PCLKT1_2/EIO
- EIO
- PCLKT1_1/EIO
- (near U35) MD3/SD7/OSC_BURST
- PMU_WAKEUPN/S4_OUT/EIO
- MISO/MD1/SD5
- MOSI/MD0/SD4
- MCSN/PCLKT0_1
- MCSNO/MSDO/
- 24MHz clock
- FPGA LFD2NX-17-7MG121I [Part 1/2]
- Project:
- Sub-system:
- Design by:
- Sheet title:
- Sheet
- A3
- of
- Checked by:
- Approved by:
- Revision:
- Document No:
- Size:
- Date:
- (in symbol LFD2NX-17-7MG121I, part A) 1 of 2

### Library data of the parts
C228 C229 = _CAP_C_2: CAP
R323-R340 = _RES_B_2: RES
U35 = LFD2NX-17-7MG121I: Description; Manufacturer_Name: Lattice; Type: Embedded; Copyright: Copyright (C) 2025 Ultra Librarian. All rights reserved.; Manufacturer_Part_Number: LFD2NX-17-7MG121I; RefDes: RefDes
Y5 = MIC6659: Manufacturer 1: Microchip Technology; Manufacturer Part Number 1: DSC1001DI5-024.0000T; Description_: MCHP CLOCK OSCILLATOR SINGLE 24MHz DSC1001DI5-024.0000 SMD-2520; Dev Tools Status: Design; Owner: Maurizio Gavardoni; Populated: YES; MCHP-ID: MIC6659; Revision: A; Symbol: DSC10xx DFN-4; Status: MCL Design; ComponentLink1Description: SVN Datasheet; ComponentLink2Description: Local Datasheet; ComponentLink3URL: C:\ALTIUM_WORK\00001_MCHP-CDB\Library\LibraryRefs\DSC10xx DFN-4.SchLib; ComponentLink3Description: Open Symbol; ComponentLink4URL: C:\ALTIUM_WORK\00001_MCHP-CDB\Library\Footprints\DFN-4_2.5x2.PcbLib; ComponentLink4Description: Open Footprint; ComponentLink5Description: Open Footprint 2; ComponentLink6Description: Open Footprint 3; ComponentLink7Description: Open Footprint 4; Category: MCHP-Clock/Timing; Type: Oscillator; Supplier 1: Digi-Key; Supplier Part Number 1: DSC1001DI5-024.0000T-ND; Quantity Override: 1

## Sheet FPGA_PART2.SchDoc
size 420 x 297 mm; SheetNumber: 30; SheetTotal: 32
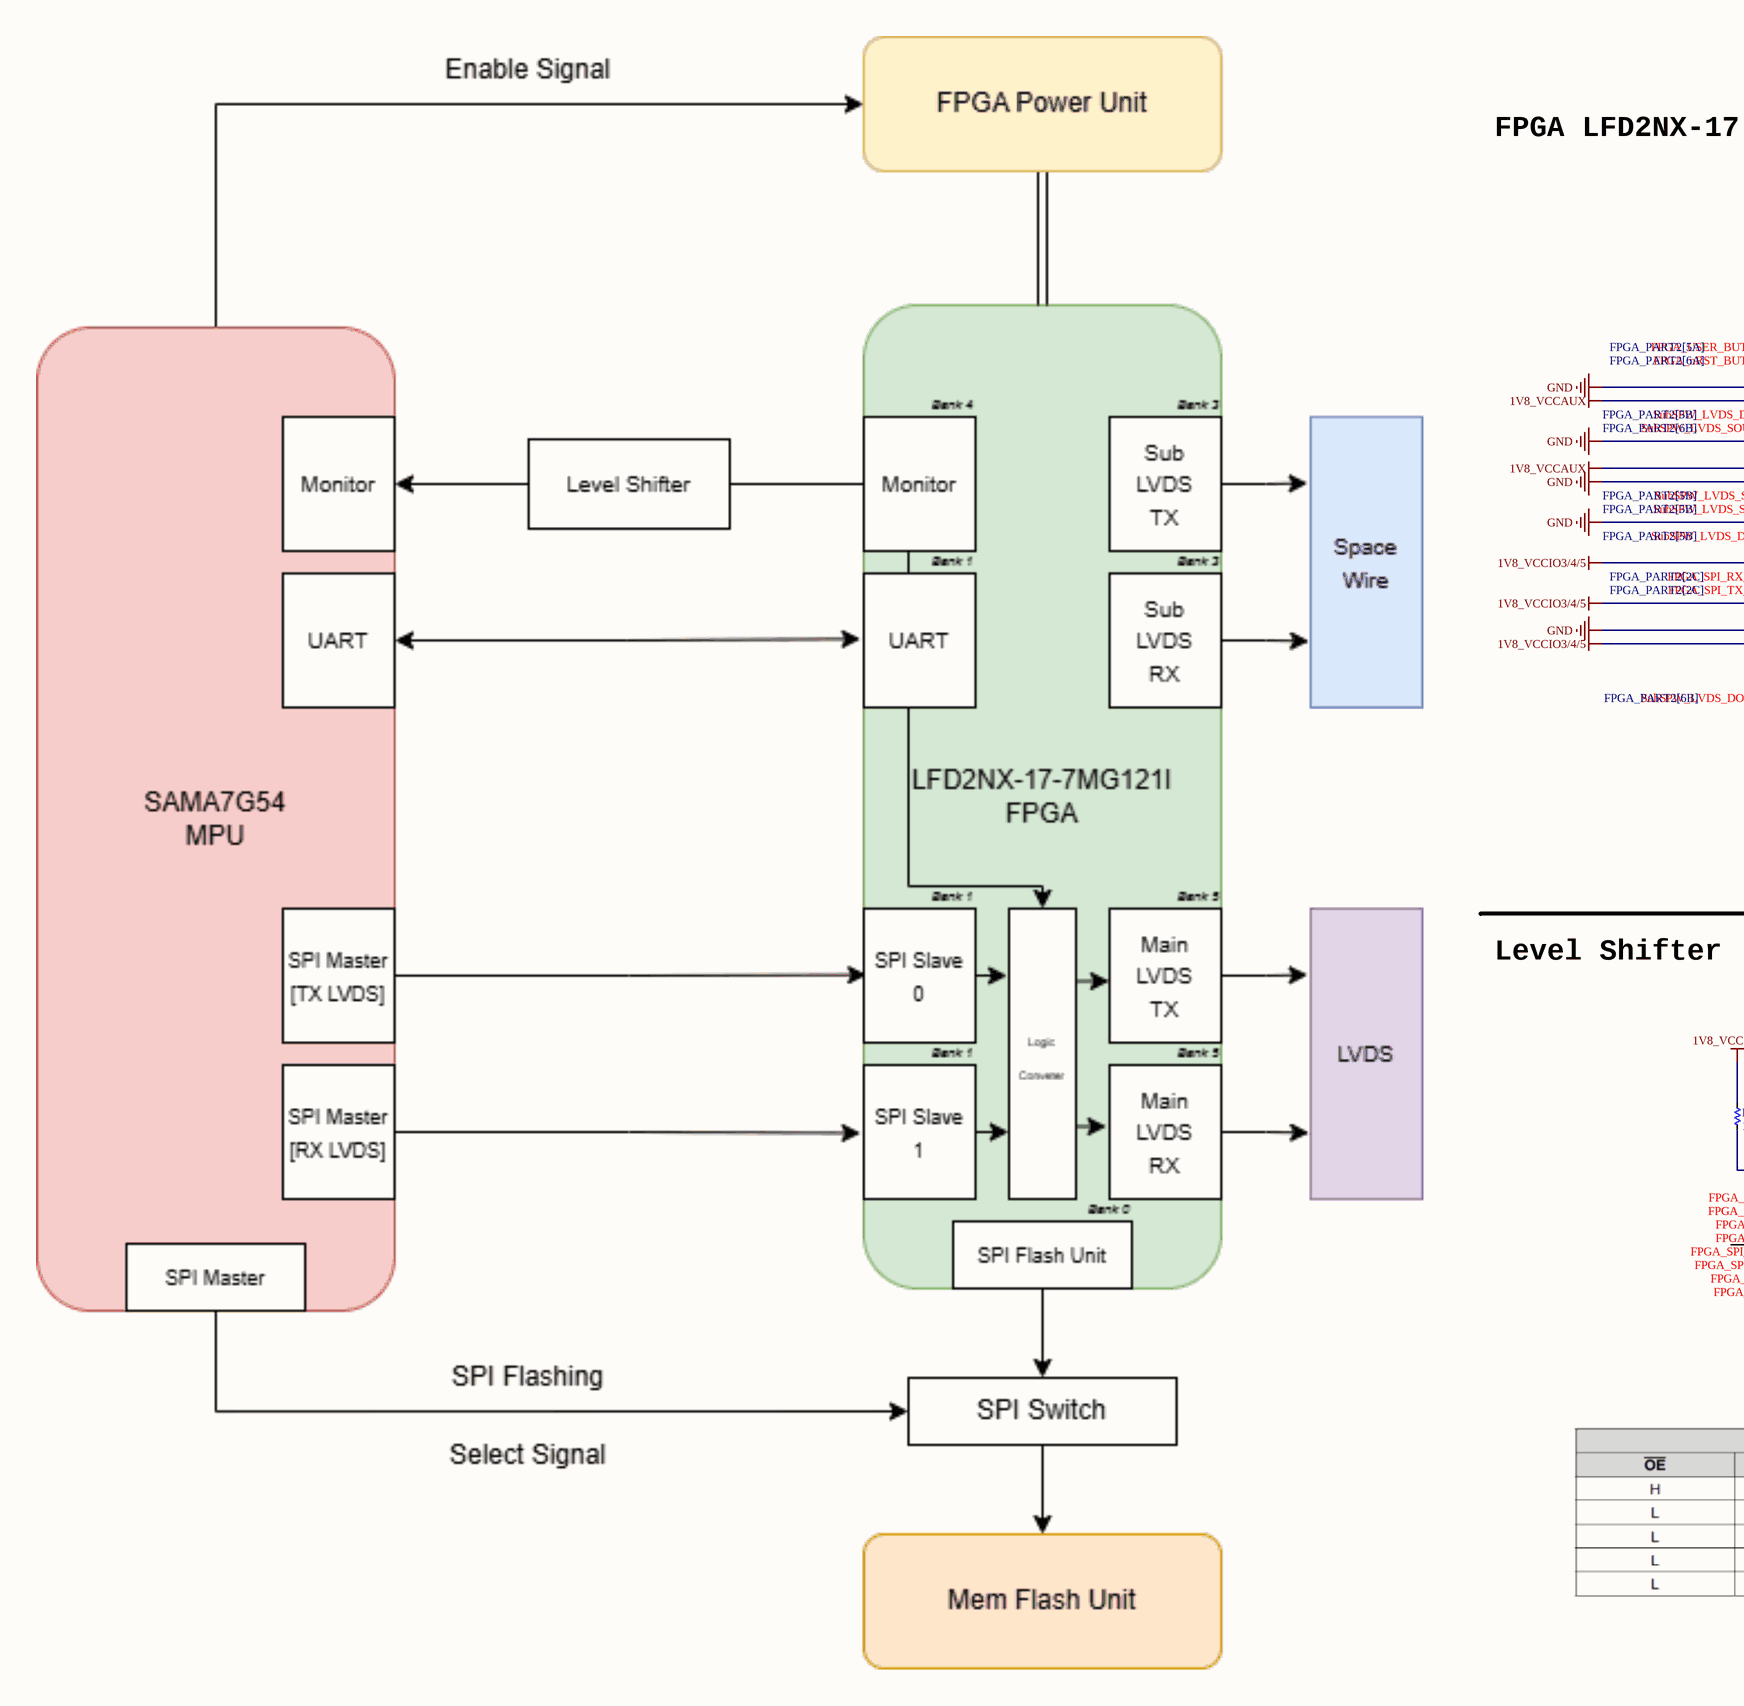
[diagram p35: FPGA_PART2.SchDoc, left]
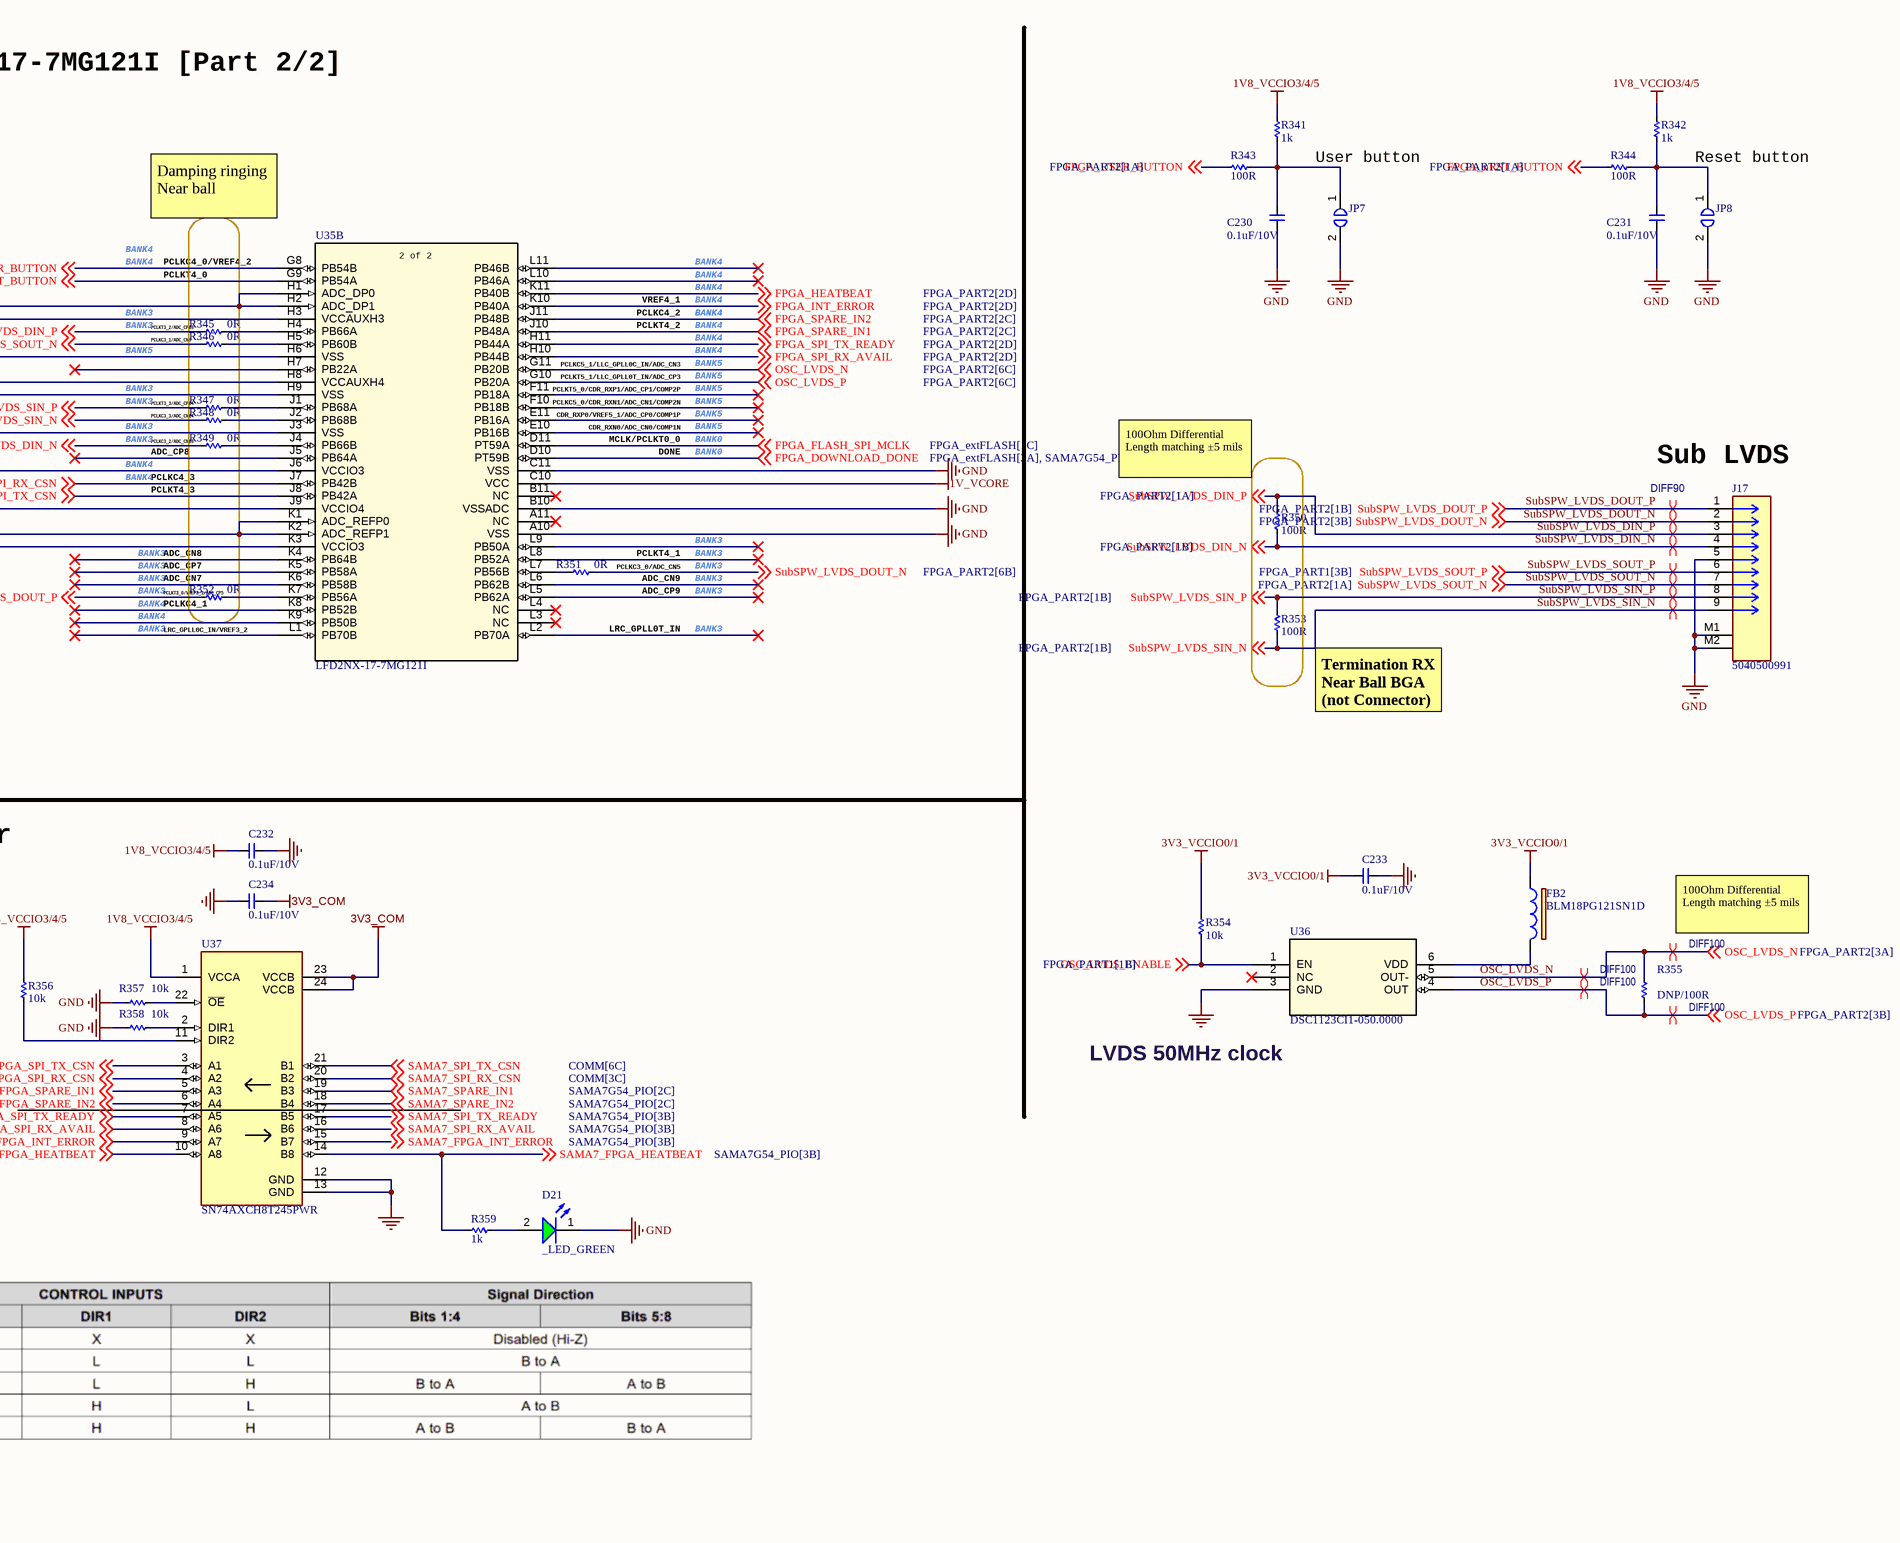
[diagram p36: FPGA_PART2.SchDoc, right]

### Parts
C230  0.1uF/10V  [CAP_C_1005X50_L]
C231  0.1uF/10V  [CAP_C_1005X50_L]
C232  0.1uF/10V  [CAP_C_1005X50_L]
C233  0.1uF/10V  [CAP_C_1005X50_L]
C234  0.1uF/10V  [CAP_C_1005X50_L]
D21  _LED_GREEN  [LED_0603]
FB2  BLM18PG121SN1D  [IND_C_1608X60]
J17  5040500991  [MOLEX_5040500991]
JP7  (no value)  [JUMPER_1608]
JP8  (no value)  [JUMPER_1608]
R341  1k  [RES_C_1005x30_L]
R342  1k  [RES_C_1005x30_L]
R343  100R  [RES_C_1005x30_L]
R344  100R  [RES_C_1005x30_L]
R345  0R  [RES_C_1005x30_L]
R346  0R  [RES_C_1005x30_L]
R347  0R  [RES_C_1005x30_L]
R348  0R  [RES_C_1005x30_L]
R349  0R  [RES_C_1005x30_L]
R350  100R  [RES_C_1005x30_L]
R351  0R  [RES_C_1005x30_L]
R352  0R  [RES_C_1005x30_L]
R353  100R  [RES_C_1005x30_L]
R354  10k  [RES_C_1005x30_L]
R355  DNP/100R  [RES_C_1005x30_L]
R356  10k  [RES_C_1005x30_L]
R357  10k  [RES_C_1005x30_L]
R358  10k  [RES_C_1005x30_L]
R359  1k  [RES_C_1005x30_L]
U35  LFD2NX-17-7MG121I  [csfBGA121_LAT]  (part B of 2)
U36  DSC1123CI1-050.0000  [VDFN6_3P2X2P5_MCH]
U37  SN74AXCH8T245PWR  [SOP65P640X120-24N]

### Nets
1V8_VCCAUX: U35.H3(VCCAUXH3) U35.H8(VCCAUXH4)
1V8_VCCIO3/4/5: C232.2 R341.2 R342.2 R356.2 U35.J6(VCCIO3) U35.J9(VCCIO4) U35.K3(VCCIO3) U37.1(VCCA)
1V_VCORE: U35.C10(VCC)
3V3_COM: C234.2 U37.23(VCCB) U37.24(VCCB)
3V3_VCCIO0/1: C233.2 FB2.2 R354.2
GND: C230.1 C231.1 C232.1 C233.1 C234.1 D21.1(K) J17.5 J17.M1 J17.M2 JP7.2 JP8.2 R357.1 R358.1 U35.A10(VSS) U35.B10(VSSADC) U35.C11(VSS) U35.H1(ADC_DP0) U35.H2(ADC_DP1) U35.H6(VSS) U35.H9(VSS) U35.J3(VSS) U35.K1(ADC_REFP0) U35.K2(ADC_REFP1) U36.3(GND) U37.12(GND) U37.13(GND)
FPGA_DOWNLOAD_DONE: U35.D10(PT59B) ; off-sheet FPGA_DOWNLOAD_DONE
FPGA_FLASH_SPI_MCLK: U35.D11(PT59A) ; off-sheet FPGA_FLASH_SPI_MCLK
FPGA_HEATBEAT: U35.K11(PB40B) U37.10(A8) ; off-sheet FPGA_HEATBEAT
FPGA_INT_ERROR: U35.K10(PB40A) U37.9(A7) ; off-sheet FPGA_INT_ERROR
FPGA_nRST_BUTTON: R344.1 U35.G9(PB54A) ; off-sheet FPGA_nRST_BUTTON
FPGA_SPARE_IN1: U35.J10(PB48A) U37.5(A3) ; off-sheet FPGA_SPARE_IN1
FPGA_SPARE_IN2: U35.J11(PB48B) U37.6(A4) ; off-sheet FPGA_SPARE_IN2
FPGA_SPI_RX_AVAIL: U35.H10(PB44B) U37.8(A6) ; off-sheet FPGA_SPI_RX_AVAIL
FPGA_SPI_RX_CSN: U35.J7(PB42B) U37.4(A2) ; off-sheet FPGA_SPI_RX_CSN
FPGA_SPI_TX_CSN: U35.J8(PB42A) U37.3(A1) ; off-sheet FPGA_SPI_TX_CSN
FPGA_SPI_TX_READY: U35.H11(PB44A) U37.7(A5) ; off-sheet FPGA_SPI_TX_READY
FPGA_USER_BUTTON: R343.1 U35.G8(PB54B) ; off-sheet FPGA_USER_BUTTON
OSC_LVDS_ENABLE: R354.1 U36.1(EN) ; off-sheet OSC_LVDS_ENABLE
OSC_LVDS_N: R355.1 U35.G11(PB20B) U36.5(OUT-) ; off-sheet OSC_LVDS_N
OSC_LVDS_P: R355.2 U35.G10(PB20A) U36.4(OUT) ; off-sheet OSC_LVDS_P
SAMA7_FPGA_HEATBEAT: R359.2 U37.14(B8) ; off-sheet SAMA7_FPGA_HEATBEAT
SAMA7_FPGA_INT_ERROR: U37.15(B7) ; off-sheet SAMA7_FPGA_INT_ERROR
SAMA7_SPARE_IN1: U37.19(B3) ; off-sheet SAMA7_SPARE_IN1
SAMA7_SPARE_IN2: U37.18(B4) ; off-sheet SAMA7_SPARE_IN2
SAMA7_SPI_RX_AVAIL: U37.16(B6) ; off-sheet SAMA7_SPI_RX_AVAIL
SAMA7_SPI_RX_CSN: U37.20(B2) ; off-sheet SAMA7_SPI_RX_CSN
SAMA7_SPI_TX_CSN: U37.21(B1) ; off-sheet SAMA7_SPI_TX_CSN
SAMA7_SPI_TX_READY: U37.17(B5) ; off-sheet SAMA7_SPI_TX_READY
SubSPW_LVDS_DIN_N: J17.4 R349.2 R350.2 ; off-sheet SubSPW_LVDS_DIN_N
SubSPW_LVDS_DIN_P: J17.3 R345.2 R350.1 ; off-sheet SubSPW_LVDS_DIN_P
SubSPW_LVDS_DOUT_N: J17.2 R351.1 ; off-sheet SubSPW_LVDS_DOUT_N
SubSPW_LVDS_DOUT_P: J17.1 R352.2 ; off-sheet SubSPW_LVDS_DOUT_P
SubSPW_LVDS_SIN_N: J17.9 R348.2 R353.2 ; off-sheet SubSPW_LVDS_SIN_N
SubSPW_LVDS_SIN_P: J17.8 R347.2 R353.1 ; off-sheet SubSPW_LVDS_SIN_P
SubSPW_LVDS_SOUT_N: J17.7 R346.2 ; off-sheet SubSPW_LVDS_SOUT_N
SubSPW_LVDS_SOUT_P: J17.6 ; off-sheet SubSPW_LVDS_SOUT_P
NetC230_2: C230.2 JP7.1 R341.1 R343.2
NetC231_2: C231.2 JP8.1 R342.1 R344.2
NetD21_2: D21.2(A) R359.1
NetFB2_1: FB2.1 U36.6(VDD)
NetR345_1: R345.1 U35.H4(PB66A)
NetR346_1: R346.1 U35.H5(PB60B)
NetR347_1: R347.1 U35.J1(PB68A)
NetR348_1: R348.1 U35.J2(PB68B)
NetR349_1: R349.1 U35.J4(PB66B)
NetR351_2: R351.2 U35.L7(PB56B)
NetR352_1: R352.1 U35.K7(PB56A)
NetR356_1: R356.1 U37.11(DIR2)
NetR357_2: R357.2 U37.22(~{OE})
NetR358_2: R358.2 U37.2(DIR1)

Not connected (* = marked no-connect by the designer): U35 A11(NC)* B11(NC)* E10(PB16B)* E11(PB16A)* F10(PB18B)* F11(PB18A)* H7(PB22A)* J5(PB64A)* K4(PB64B)* K5(PB58A)* K6(PB58B)* K8(PB52B)* K9(PB50B)* L1(PB70B)* L2(PB70A)* L3(NC)* L4(NC)* L5(PB62A)* L6(PB62B)* L8(PB52A)* L9(PB50A)* L10(PB46A)* L11(PB46B)*; U36 2(NC)*

### Layout directives
differential pair; differential pair class DIFF90; net class DIFF90; rule Matched Net Lengths [Tolerance = 4mil]: SubSPW_LVDS_DIN_N, SubSPW_LVDS_DIN_P, SubSPW_LVDS_DOUT_N, SubSPW_LVDS_DOUT_P, SubSPW_LVDS_SIN_N, SubSPW_LVDS_SIN_P, SubSPW_LVDS_SOUT_N, SubSPW_LVDS_SOUT_P
differential pair; differential pair class DIFF100; net class DIFF100; rule Matched Net Lengths [Tolerance = 4mil]: OSC_LVDS_N, OSC_LVDS_P

### Notes on the sheet
- FPGA LFD2NX-17-7MG121I [Part 2/2]
- User button
- Reset button
- Damping ringing
  Near ball
- BANK4
- PCLKC4_0/VREF4_2
- PCLKT4_0
- VREF4_1
- BANK3
- BANK5
- PCLKT3_2/ADC_CP13
- PCLKC3_1/ADC_CN6
- PCLKC5_1/LLC_GPLL0C_IN/ADC_CN3
- PCLKT4_2
- PCLKC4_2
- PCLKT3_3/ADC_CP14
- PCLKC3_3/ADC_CN14
- CDR_RXN0/ADC_CN0/COMP1N
- CDR_RXP0/VREF5_1/ADC_CP0/COMP1P
- PCLKC5_0/CDR_RXN1/ADC_CN1/COMP2N
- PCLKT5_0/CDR_RXP1/ADC_CP1/COMP2P
- PCLKT5_1/LLC_GPLL0T_IN/ADC_CP3
- PCLKC3_2/ADC_CN13
- ADC_CP8
- (near R349) PCLKC4_3
- PCLKT4_3
- DONE
- MCLK/PCLKT0_0
- BANK0
- (near R350) 100Ohm Differential
  Length matching ±5 mils
- (near J17) Sub LVDS
- (near R352) ADC_CN8
- PCLKT4_1
- (near R352) BANK3
- (near R352) BANK4
- (near R352) ADC_CP7
- (near R352) ADC_CN7
- (near R352) PCLKT3_0/VREF3_1/ADC_CP5
- (near R352) PCLKC4_1
- ADC_CP9
- ADC_CN9
- (near R351) PCLKC3_0/ADC_CN5
- (near R352) LRC_GPLL0C_IN/VREF3_2
- LRC_GPLL0T_IN
- (near R353) Termination RX
  Near Ball BGA (not Connector)
- Level Shifter
- 100Ohm Differential
  Length matching ±5 mils
- LVDS 50MHz clock
- Project:
- Sub-system:
- Design by:
- Sheet title:
- Sheet
- A3
- of
- Checked by:
- Approved by:
- Revision:
- Document No:
- Size:
- Date:
- (in symbol LFD2NX-17-7MG121I, part B) 2 of 2

### Library data of the parts
C230-C234 = _CAP_C_2: CAP
D21 = LED_GREEN: LED GREEN CLEAR 0603 SMD
FB2 = BLM18PG121SN1D: as FB1#2 on sheet FPGA_POWER; Copyright: Copyright (C) 2025 Ultra Librarian. All rights reserved.; Manufacturer_Part_Number: BLM18PG121SN1D
J17 = 5040500991: Connector Header Surface Mount, Right Angle 9 position 0.059" (1.50mm)
JP7 JP8 = JUMPER_1_1
R341-R359 = _RES_B_2: RES
U35 = LFD2NX-17-7MG121I: Description; Manufacturer_Name: Lattice; Type: Embedded; Copyright: Copyright (C) 2025 Ultra Librarian. All rights reserved.; Manufacturer_Part_Number: LFD2NX-17-7MG121I; RefDes: RefDes
U36 = DSC11x3CIx-x: No Description Available; Manufacturer_Name: Microchip; Manufacturer_Part_Number: DSC1103CI2-180.0000T; Copyright: Copyright (C) 2026 Ultra Librarian. All rights reserved.; RefDes: RefDes; Type: Type
U37 = IC_voltage_level_SN74AXCH8T245PWR: 8-Bit Dual-Supply Bus Transceiver; MF: Texas Instruments; MP: SN74AXCH8T245PWR; Value: *; Check_prices: https://www.snapeda.com/parts/SN74AXCH8T245PWR/Texas+Instruments/view-part/?ref=eda; SnapEDA_Link: https://www.snapeda.com/parts/SN74AXCH8T245PWR/Texas+Instruments/view-part/?ref=snap; Price: None; Availability: In Stock; Purchase-URL: https://pricing.snapeda.com/search/part/SN74AXCH8T245PWR/?ref=eda; Package: TSSOP-24 Texas Instruments

## Sheet FPGA_extFLASH.SchDoc
size 420 x 297 mm; SheetNumber: 31; SheetTotal: 32
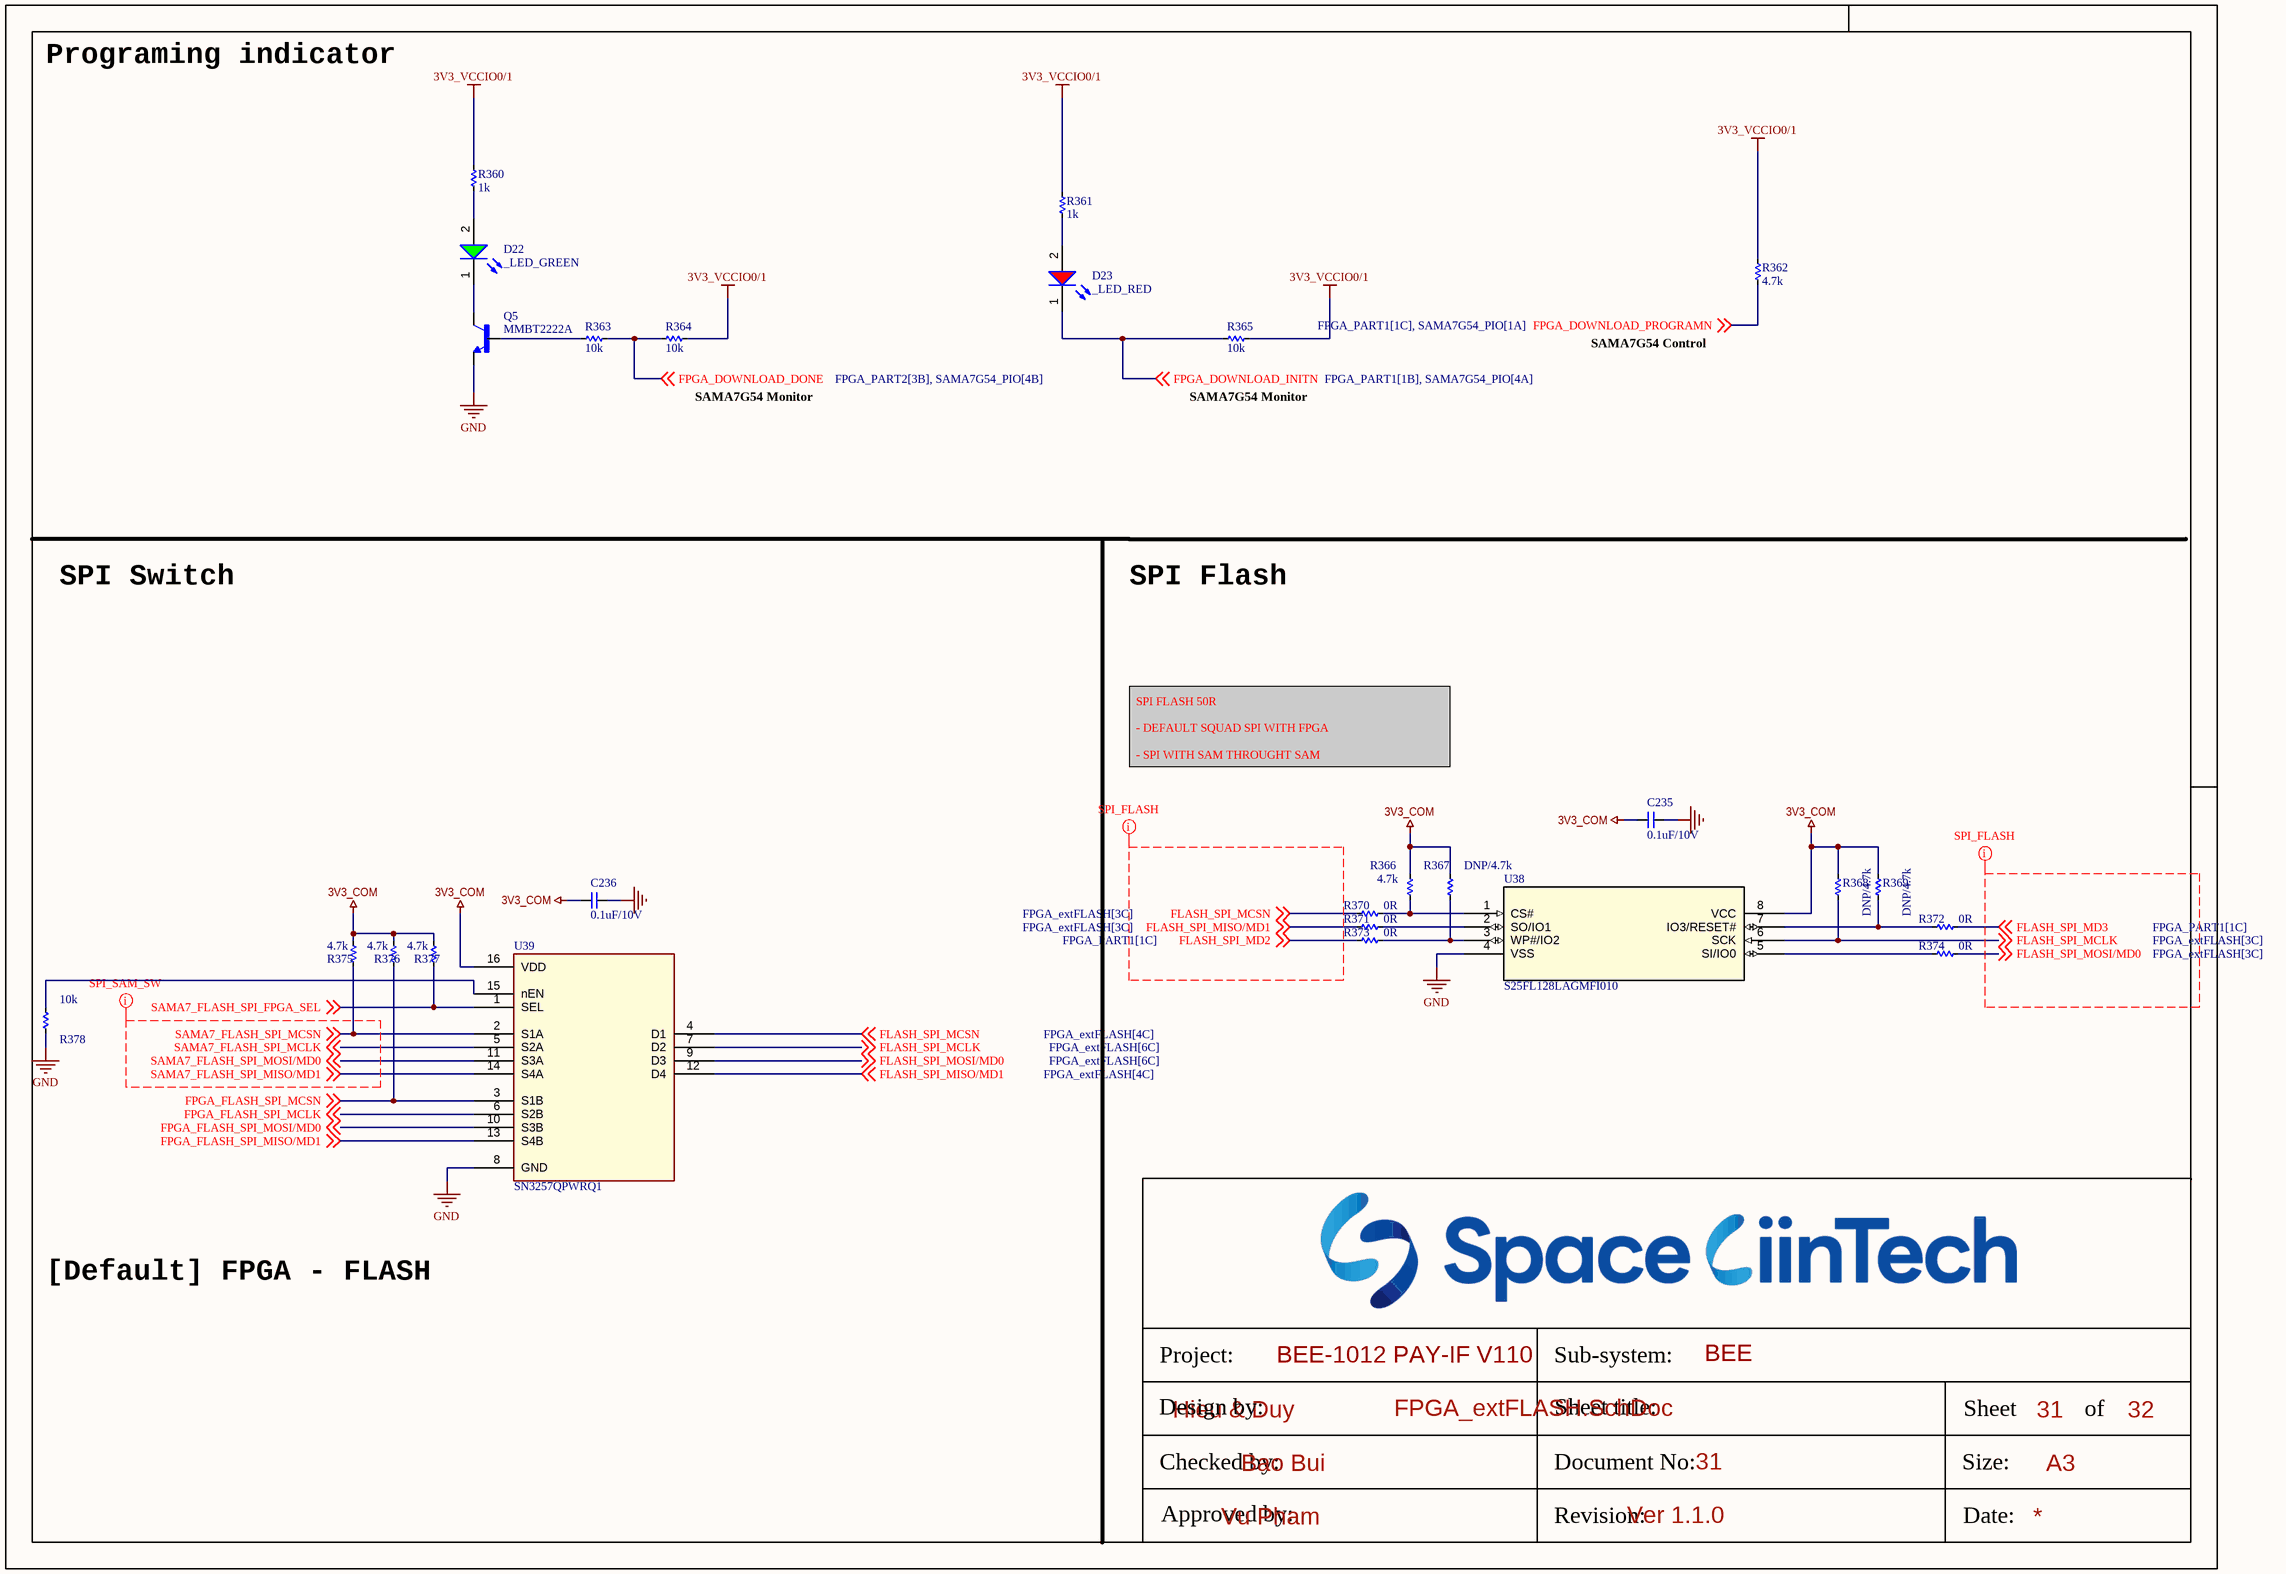
[diagram p37: FPGA_extFLASH.SchDoc]

### Parts
C235  0.1uF/10V  [CAP_C_1005X50_L]
C236  0.1uF/10V  [CAP_C_1005X50_L]
D22  _LED_GREEN  [LED_0603]
D23  _LED_RED  [LED_0603]
Q5  MMBT2222A  [SOT95P240X120-3N]
R360  1k  [RES_C_1005x30_L]
R361  1k  [RES_C_1005x30_L]
R362  4.7k  [RES_C_1005x30_L]
R363  10k  [RES_C_1005x30_L]
R364  10k  [RES_C_1005x30_L]
R365  10k  [RES_C_1005x30_L]
R366  4.7k  [RES_C_1005x30_L]
R367  DNP/4.7k  [RES_C_1005x30_L]
R368  DNP/4.7k  [RES_C_1005x30_L]
R369  DNP/4.7k  [RES_C_1005x30_L]
R370  0R  [RES_C_1005x30_L]
R371  0R  [RES_C_1005x30_L]
R372  0R  [RES_C_1005x30_L]
R373  0R  [RES_C_1005x30_L]
R374  0R  [RES_C_1005x30_L]
R375  4.7k  [RES_C_1005x30_L]
R376  4.7k  [RES_C_1005x30_L]
R377  4.7k  [RES_C_1005x30_L]
R378  10k  [RES_C_1005x30_L]
U38  S25FL128LAGMFI010  [SOIC8_S25FL_CYP]
U39  SN3257QPWRQ1  [SOIC_PRQ1_TEX]

### Nets
3V3_COM: C235.2 C236.2 R366.2 R367.2 R368.2 R369.2 R375.2 R376.2 R377.2 U38.8(VCC) U39.16(VDD)
3V3_VCCIO0/1: R360.2 R361.2 R362.2 R364.1 R365.1
GND: C235.1 C236.1 Q5.2(E) R378.1 U38.4(VSS) U39.8(GND)
FLASH_SPI_MCLK: R368.1 U38.6(SCK) U39.7(D2) ; off-sheet FLASH_SPI_MCLK
FLASH_SPI_MCSN: R370.1 U39.4(D1) ; off-sheet FLASH_SPI_MCSN
FLASH_SPI_MD2: R373.1 ; off-sheet FLASH_SPI_MD2
FLASH_SPI_MD3: R372.2 ; off-sheet FLASH_SPI_MD3
FLASH_SPI_MISO/MD1: R371.1 U39.12(D4) ; off-sheet FLASH_SPI_MISO/MD1
FLASH_SPI_MOSI/MD0: R374.2 U39.9(D3) ; off-sheet FLASH_SPI_MOSI/MD0
FPGA_DOWNLOAD_DONE: R363.1 R364.2 ; off-sheet FPGA_DOWNLOAD_DONE
FPGA_DOWNLOAD_INITN: D23.1(K) R365.2 ; off-sheet FPGA_DOWNLOAD_INITN
FPGA_DOWNLOAD_PROGRAMN: R362.1 ; off-sheet FPGA_DOWNLOAD_PROGRAMN
FPGA_FLASH_SPI_MCLK: U39.6(S2B) ; off-sheet FPGA_FLASH_SPI_MCLK
FPGA_FLASH_SPI_MCSN: R376.1 U39.3(S1B) ; off-sheet FPGA_FLASH_SPI_MCSN
FPGA_FLASH_SPI_MISO/MD1: U39.13(S4B) ; off-sheet FPGA_FLASH_SPI_MISO/MD1
FPGA_FLASH_SPI_MOSI/MD0: U39.10(S3B) ; off-sheet FPGA_FLASH_SPI_MOSI/MD0
SAMA7_FLASH_SPI_FPGA_SEL: R377.1 U39.1(SEL) ; off-sheet SAMA7_FLASH_SPI_FPGA_SEL
SAMA7_FLASH_SPI_MCLK: U39.5(S2A) ; off-sheet SAMA7_FLASH_SPI_MCLK
SAMA7_FLASH_SPI_MCSN: R375.1 U39.2(S1A) ; off-sheet SAMA7_FLASH_SPI_MCSN
SAMA7_FLASH_SPI_MISO/MD1: U39.14(S4A) ; off-sheet SAMA7_FLASH_SPI_MISO/MD1
SAMA7_FLASH_SPI_MOSI/MD0: U39.11(S3A) ; off-sheet SAMA7_FLASH_SPI_MOSI/MD0
NetD22_1: D22.1(K) Q5.3(C)
NetD22_2: D22.2(A) R360.1
NetD23_2: D23.2(A) R361.1
NetQ5_1: Q5.1(B) R363.2
NetR366_1: R366.1 R370.2 U38.1(CS#)
NetR367_1: R367.1 R373.2 U38.3(WP#/IO2)
NetR369_1: R369.1 R372.1 U38.7(IO3/RESET#)
NetR371_2: R371.2 U38.2(SO/IO1)
NetR374_1: R374.1 U38.5(SI/IO0)
NetR378_2: R378.2 U39.15(nEN)

### Layout directives
net class FLASH_SAM_FPGA: FLASH_SPI_MCLK, FLASH_SPI_MCSN, FLASH_SPI_MD2, FLASH_SPI_MD3, FLASH_SPI_MISO/MD1, FLASH_SPI_MOSI/MD0
mark named SPI_SAM_SW: SAMA7_FLASH_SPI_MCLK, SAMA7_FLASH_SPI_MCSN, SAMA7_FLASH_SPI_MISO/MD1, SAMA7_FLASH_SPI_MOSI/MD0

### Notes on the sheet
- Programing indicator
- SAMA7G54 Control
- SAMA7G54 Monitor
- (near R365) SAMA7G54 Monitor
- SPI Switch
- SPI Flash
- SPI FLASH 50R
  - DEFAULT SQUAD SPI WITH FPGA
  - SPI WITH SAM THROUGHT SAM
- [Default] FPGA - FLASH
- Project:
- Sub-system:
- Design by:
- Sheet title:
- Sheet
- A3
- of
- Checked by:
- Approved by:
- Revision:
- Document No:
- Size:
- Date:

### Library data of the parts
C235 C236 = _CAP_C_2: CAP
D22 = LED_GREEN: LED GREEN CLEAR 0603 SMD
D23 = LED_RED: LED RED CLEAR 0603 SMD
Q5 = BJT_NPN_BEC: MF: Diotec Semiconductor; SnapEDA_Link: https://www.snapeda.com/parts/MMBT2222A/Diotec/view-part/?ref=snap; Package: SOT-23 Diotec; Value: *; MP: MMBT2222A; Check_prices: https://www.snapeda.com/parts/MMBT2222A/Diotec/view-part/?ref=eda
R360-R378 = _RES_B_2: RES
U38 = S25FL128LAGMFI010: Description; Manufacturer_Name: Cypress Semiconductor; Copyright: Copyright (C) 2025 Ultra Librarian. All rights reserved.; Manufacturer_Part_Number: S25FL128LAGMFI010; RefDes: RefDes; Type: Type
U39 = IC_SW_SPI_SN3257QPWRQ1: Automotive 5-V, 2:1 (SPDT), 4-channel switch with 1.8-V logic and powered-off protection 16-TSSOP -40 to 125; Manufacturer_Name: Texas Instruments; Copyright: Copyright (C) 2025 Ultra Librarian. All rights reserved.; Manufacturer_Part_Number: SN3257QPWRQ1; Datasheet: https://www.ti.com/lit/gpn/sn3257-q1; RefDes: RefDes; Type: Type

## Sheet ChangeNote.SchDoc
size 420 x 297 mm; SheetNumber: 32; SheetTotal: 32
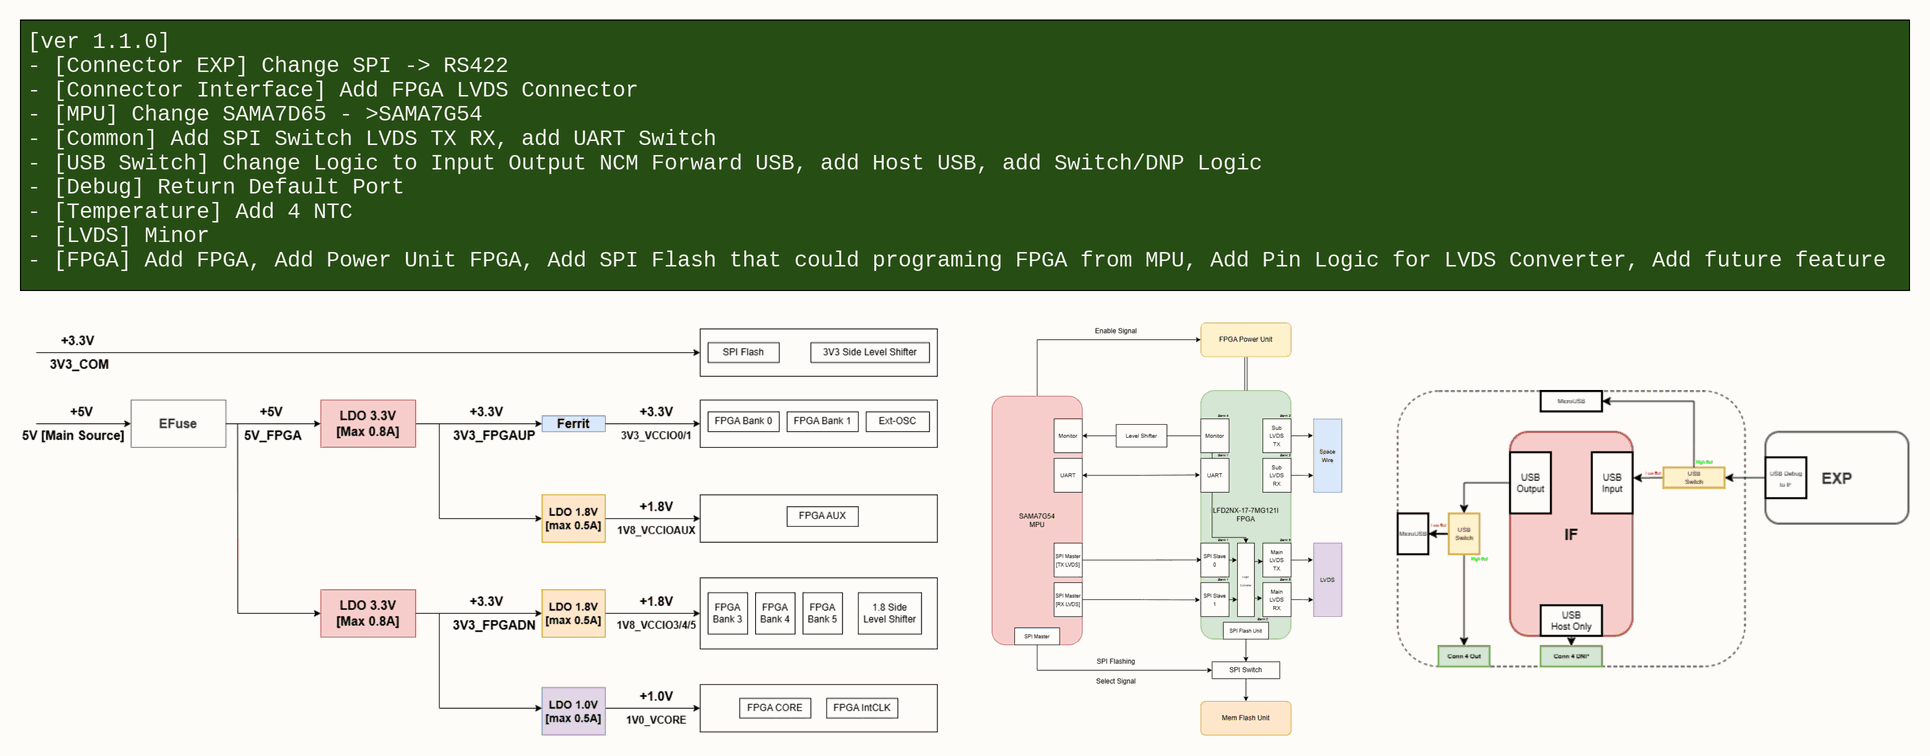
[diagram p38: ChangeNote.SchDoc]

### Notes on the sheet
- [ver 1.1.0]
  - [Connector EXP] Change SPI -> RS422
  - [Connector Interface] Add FPGA LVDS Connector
  - [MPU] Change SAMA7D65 - >SAMA7G54
  - [Common] Add SPI Switch LVDS TX RX, add UART Switch
  - [USB Switch] Change Logic to Input Output NCM Forward USB, add Host USB, add Switch/DNP Logic
  - [Debug] Return Default Port
  - [Temperature] Add 4 NTC
  - [LVDS] Minor
  - [FPGA] Add FPGA, Add Power Unit FPGA, Add SPI Flash that could programing FPGA from MPU, Add Pin Logic for LVDS Converter, Add future feature SpaceWire
- Project:
- Sub-system:
- Design by:
- Sheet title:
- Sheet
- A3
- of
- Checked by:
- Approved by:
- Revision:
- Document No:
- Size:
- Date: